# EAGLE design IOTKit_V1 (EAGLE 6.4)

## Sheet 1 of 2
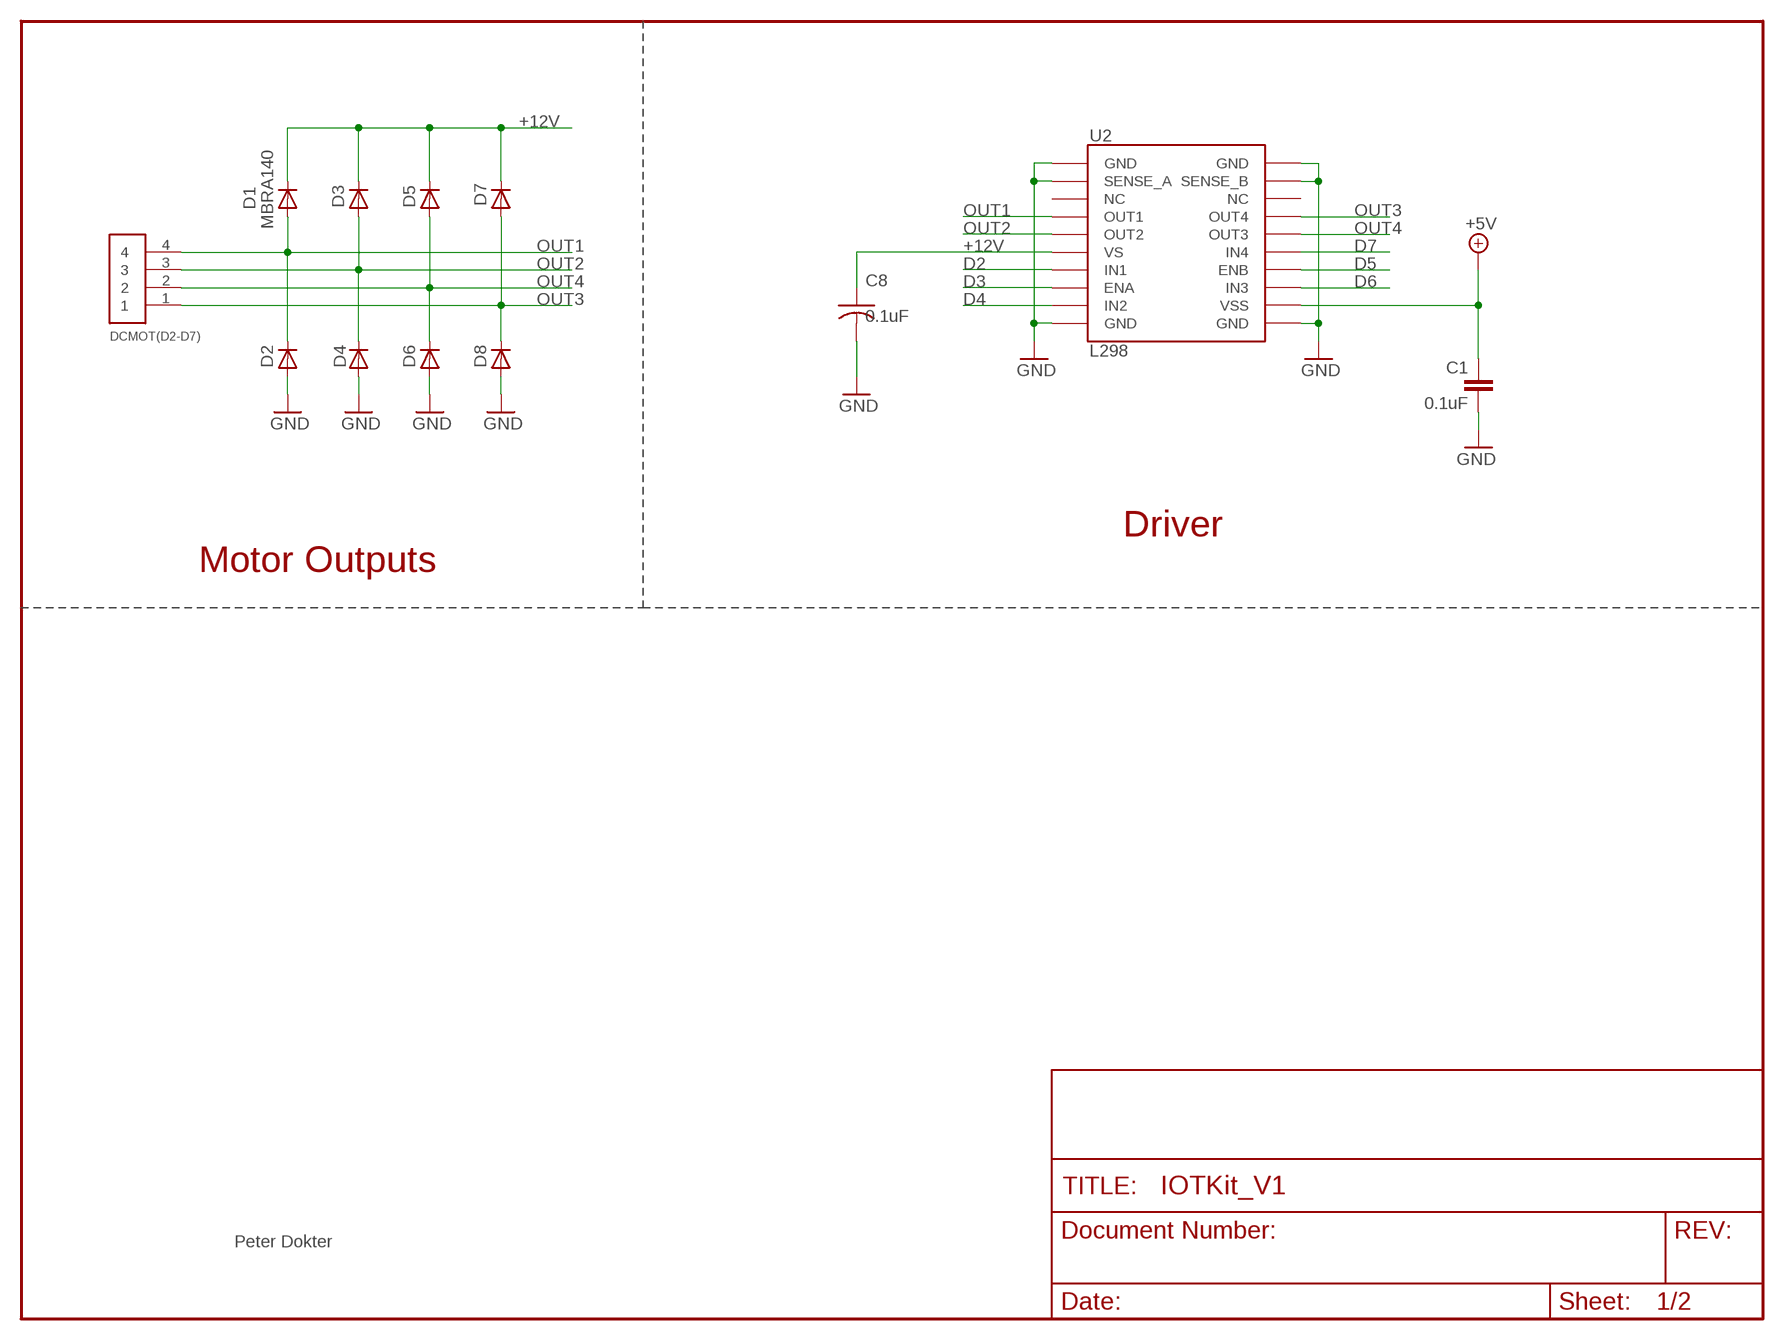
[diagram p0: schematic, sheet 1]

### Parts
C1  0.1uF  CAP0402-CAP  [0402-CAP]
C8  0.1uF  C-USC0603K  [C0603K]
D1  MBRA140  DIODESMA  [SMA-DIODE]
D2  MBRA140  DIODESMA  [SMA-DIODE]
D3  MBRA140  DIODESMA  [SMA-DIODE]
D4  MBRA140  DIODESMA  [SMA-DIODE]
D5  MBRA140  DIODESMA  [SMA-DIODE]
D6  MBRA140  DIODESMA  [SMA-DIODE]
D7  MBRA140  DIODESMA  [SMA-DIODE]
D8  MBRA140  DIODESMA  [SMA-DIODE]
DCMOT(D2-D7)  1X4  [1X04_LINE]
U2  L298  L298_BRIDGE_DRIVER  [POWERSO20]

### Nets
+5V: C1.1 U2.P$12(VSS) ; also sheet 2
+12V: C8.1 D1.C D3.C D5.C D7.C U2.P$6(VS) ; also sheet 2
D2: U2.P$7(IN1) ; also sheet 2
D3: U2.P$8(ENA) ; also sheet 2
D4: U2.P$9(IN2) ; also sheet 2
D5: U2.P$14(ENB) ; also sheet 2
D6: U2.P$13(IN3) ; also sheet 2
D7: U2.P$15(IN4) ; also sheet 2
GND: C1.2 C8.2 D2.A D4.A D6.A D8.A U2.P$1(GND) U2.P$2(SENSE_A) U2.P$10(GND) U2.P$11(GND) U2.P$19(SENSE_B) U2.P$20(GND) ; also sheet 2
OUT1: D1.A D2.C DCMOT(D2-D7).4 U2.P$4(OUT1)
OUT2: D3.A D4.C DCMOT(D2-D7).3 U2.P$5(OUT2)
OUT3: D7.A D8.C DCMOT(D2-D7).1 U2.P$17(OUT4)
OUT4: D5.A D6.C DCMOT(D2-D7).2 U2.P$16(OUT3)
Unconnected: U2.P$3(NC) U2.P$18(NC)

### Notes on the sheet
- Driver
- Motor Outputs
- Peter Dokter

## Sheet 2 of 2
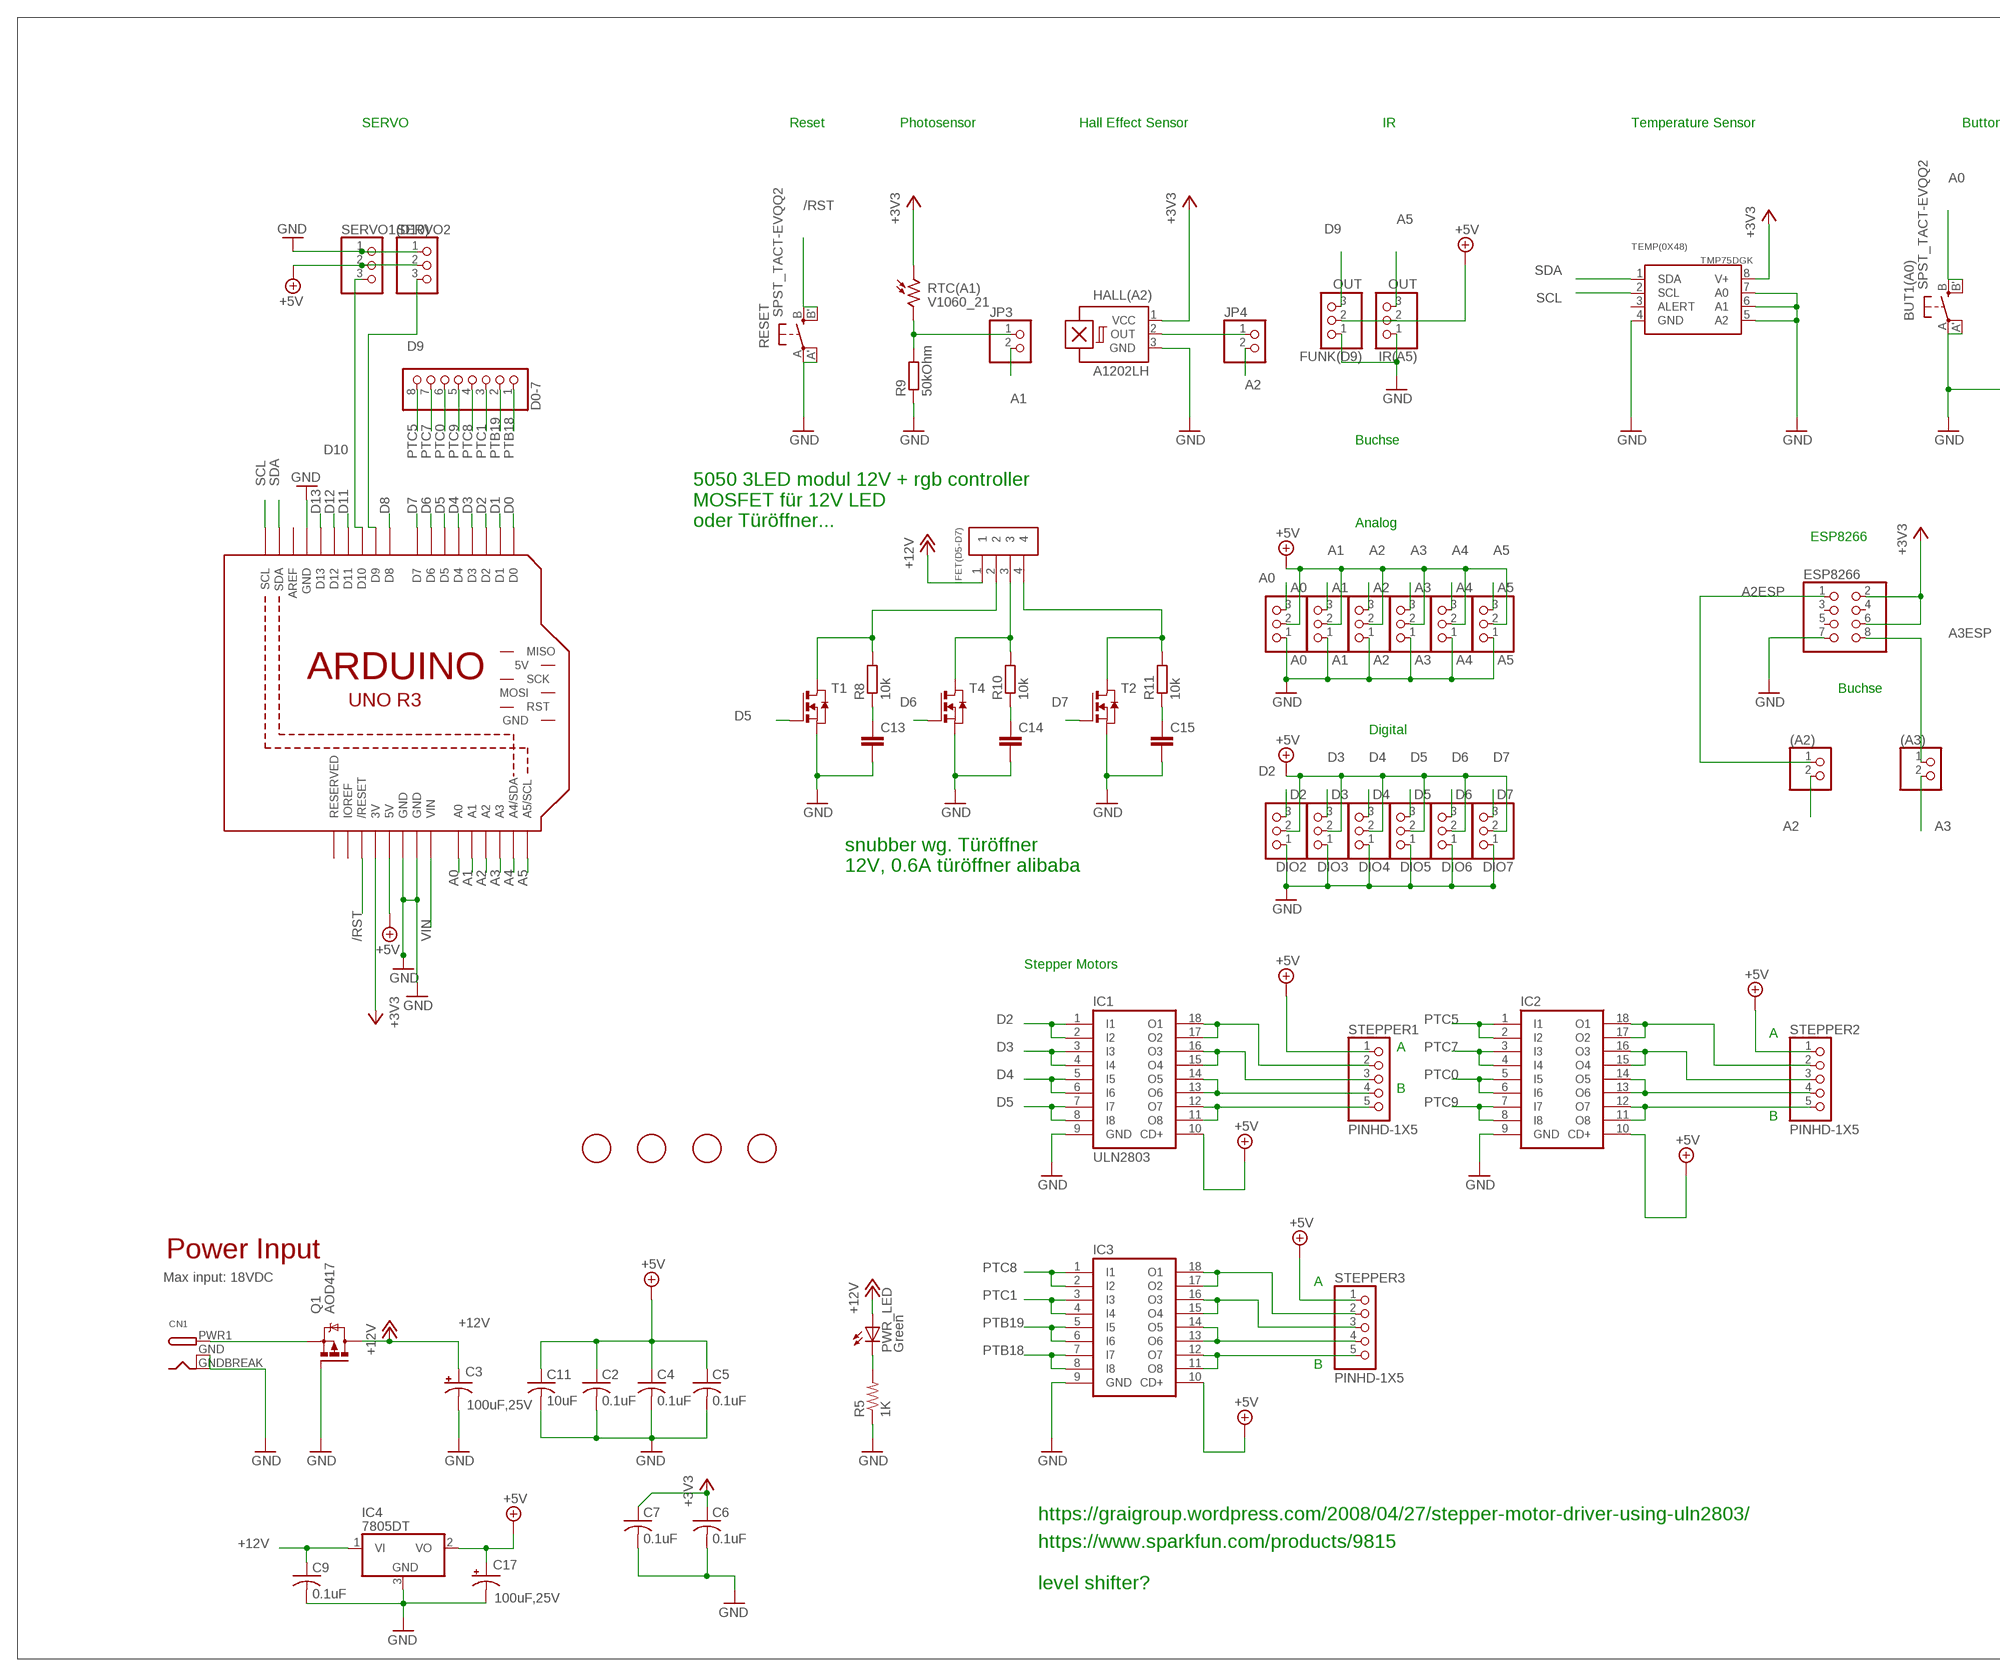
[diagram p1: schematic, sheet 2, part 1 of 2]
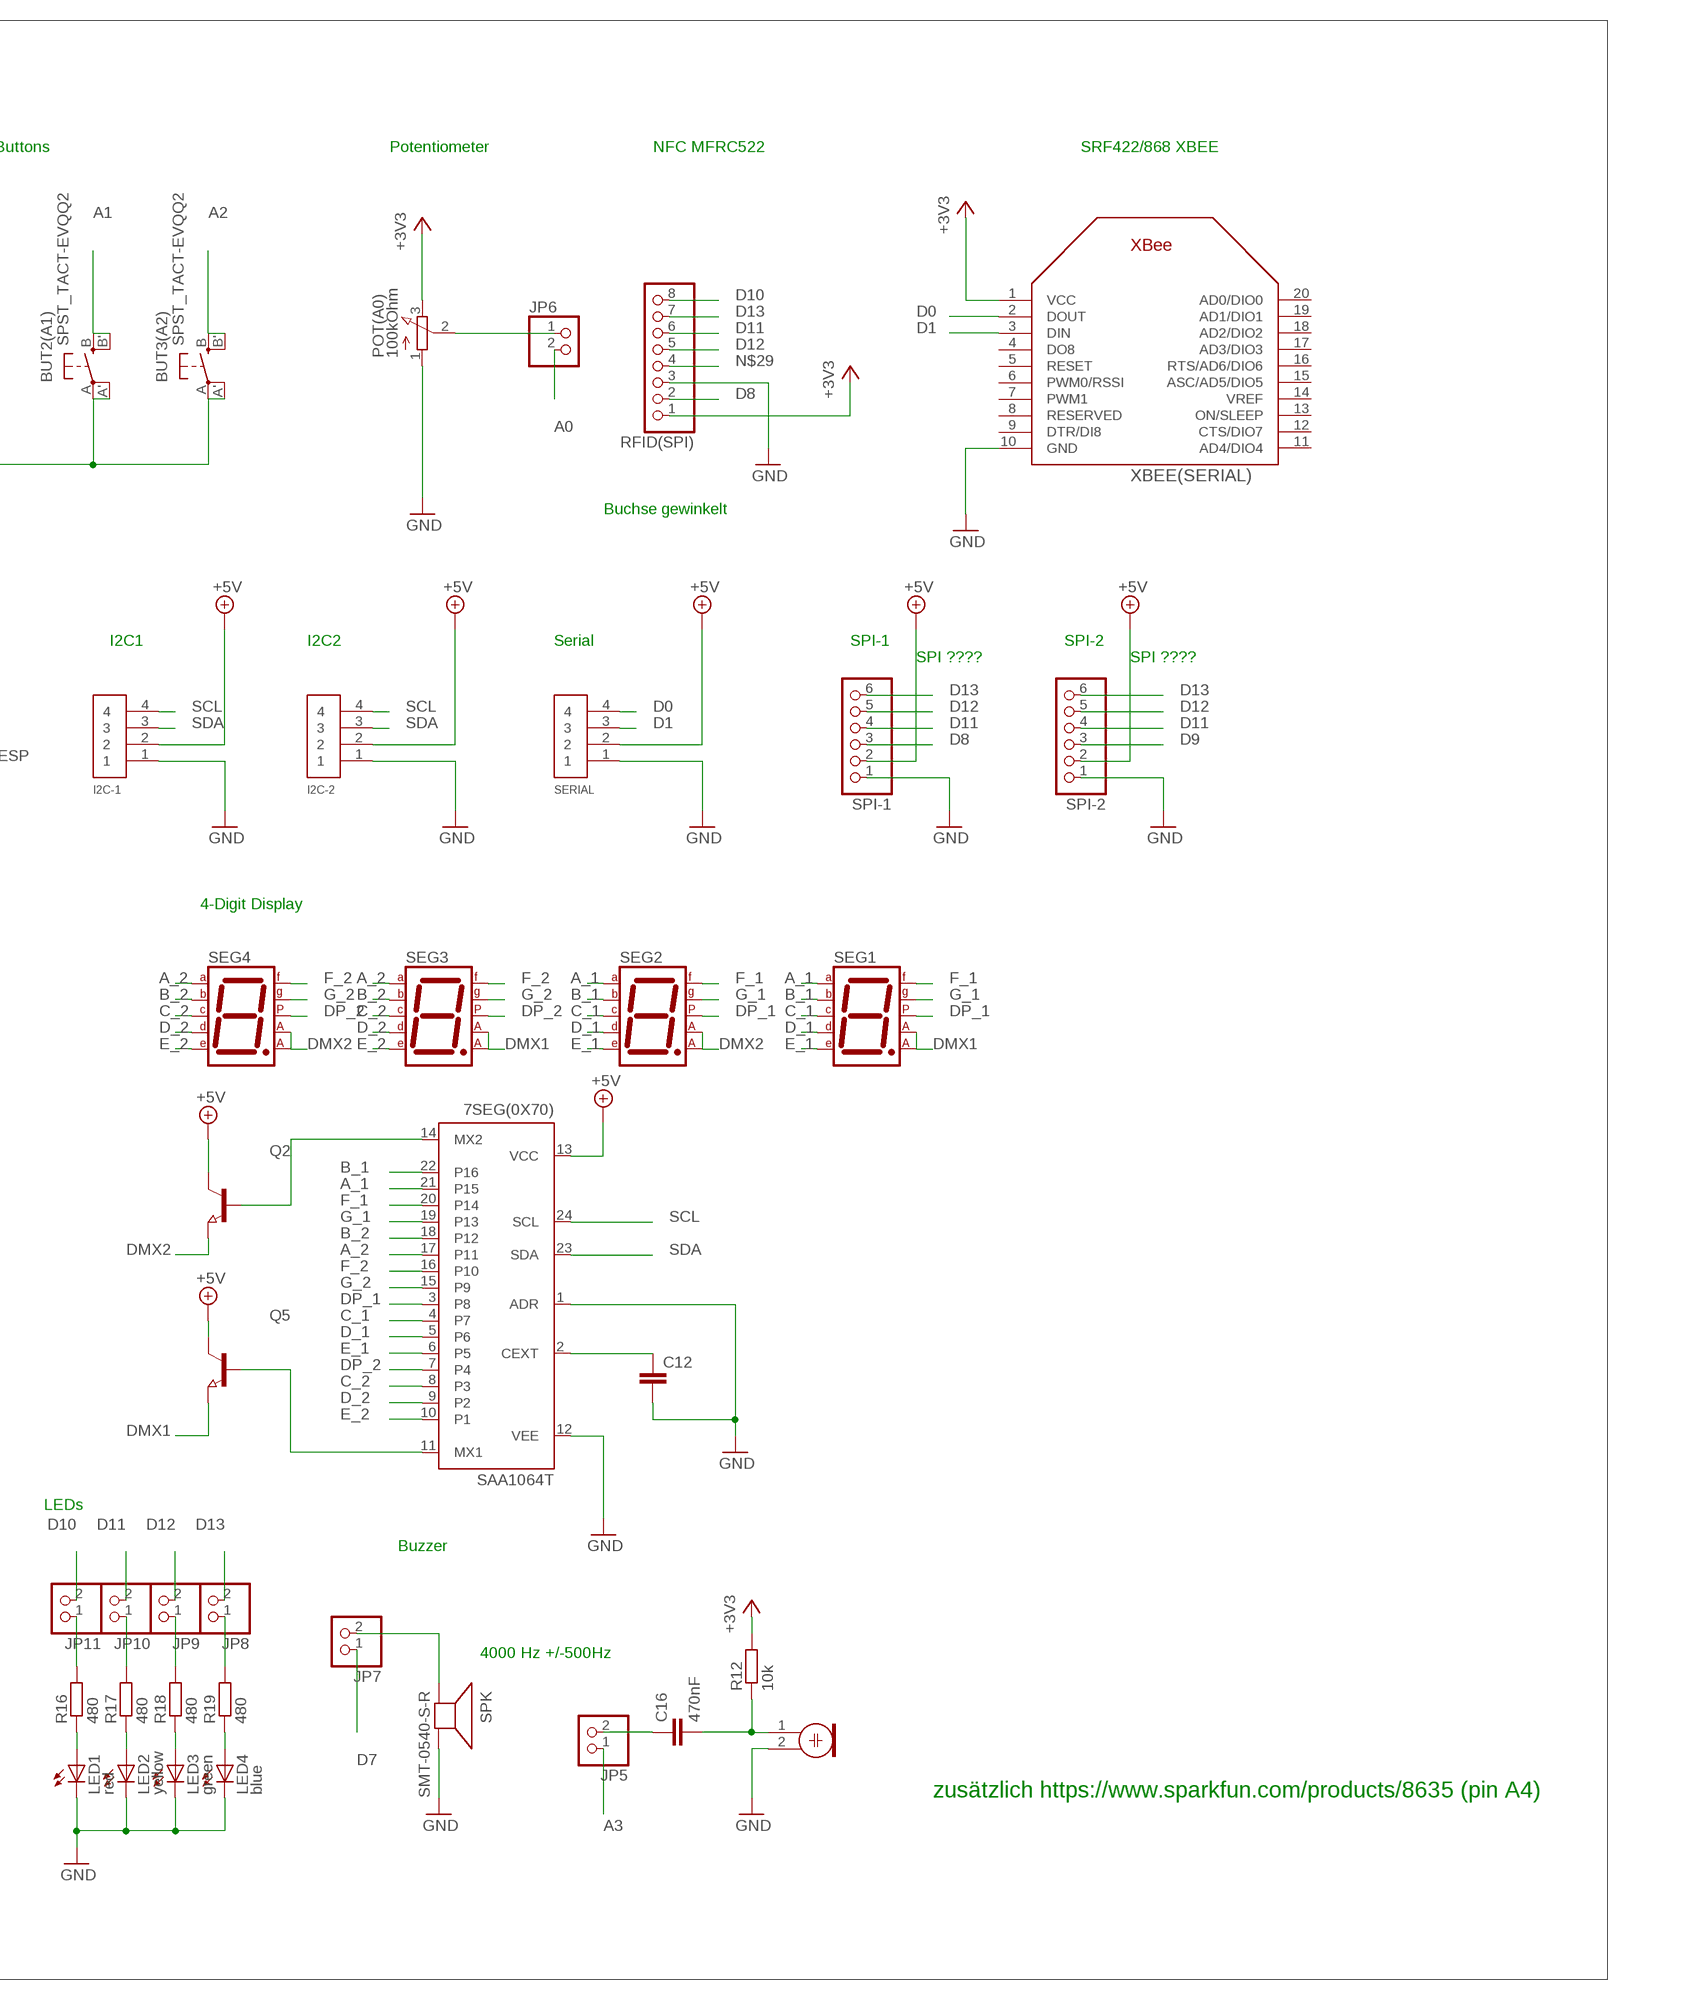
[diagram p2: schematic, sheet 2, part 2 of 2]

### Parts
7SEG(0X70)  SAA1064T  [SO24]
(A2)  PINHD-1X2  [1X02_LINE]
(A3)  PINHD-1X2  [1X02_LINE]
A0  A0  PINHD-1X3  [1X03_LINE]
A1  A1  PINHD-1X3  [1X03_LINE]
A2  A2  PINHD-1X3  [1X03_LINE]
A3  A3  PINHD-1X3  [1X03_LINE]
A4  A4  PINHD-1X3  [1X03_LINE]
A5  A5  PINHD-1X3  [1X03_LINE]
BUT1(A0)  SPST_TACT-EVQQ2  [EVQ-Q2]
BUT2(A1)  SPST_TACT-EVQQ2  [EVQ-Q2]
BUT3(A2)  SPST_TACT-EVQQ2  [EVQ-Q2]
C2  0.1uF  C-USC0603K  [C0603K]
C3  100uF,25V  CAP_POLF80  [NIPPON_F80]
C4  0.1uF  C-USC0603K  [C0603K]
C5  0.1uF  C-USC0603K  [C0603K]
C6  0.1uF  C-USC0603K  [C0603K]
C7  0.1uF  C-USC0603K  [C0603K]
C9  0.1uF  C-USC0805K  [C0805K]
C11  10uF  C-USC0805K  [C0805K]
C12  C-EUC0603  [C0603]
C13  C-EUC0603  [C0603]
C14  C-EUC0603  [C0603]
C15  C-EUC0603  [C0603]
C16  470nF  C-EUC0603  [C0603]
C17  100uF,25V  CAP_POLF80  [NIPPON_F80]
CN1  DCBARRELSMT  [DCJACK_2MM_SMT]
D0-7  PINHD-1X8CLEANBIG  [1X08-CLEANBIG]
DIO2  D2  PINHD-1X3  [1X03_LINE]
DIO3  D3  PINHD-1X3  [1X03_LINE]
DIO4  D4  PINHD-1X3  [1X03_LINE]
DIO5  D5  PINHD-1X3  [1X03_LINE]
DIO6  D6  PINHD-1X3  [1X03_LINE]
DIO7  D7  PINHD-1X3  [1X03_LINE]
ESP8266  PINHD-2X4  [2X04]
FET(D5-D7)  1X4  [1X04_LINE]
FUNK(D9)  OUT  PINHD-1X3  [1X03_LINE]
HALL(A2)  A1202LH  [SOT23-W]
I2C-1  1X4  [1X04_LINE]
I2C-2  1X4  [1X04_LINE]
IC1  ULN2803  ULN2803ASO18W  [SO18W]
IC2  ULN2803ASO18W  [SO18W]
IC3  ULN2803ASO18W  [SO18W]
IC4  7805DT  [TO252]
IR(A5)  OUT  PINHD-1X3  [1X03_LINE]
JP3  PINHD-1X2  [1X02_LINE]
JP4  PINHD-1X2  [1X02_LINE]
JP5  PINHD-1X2  [1X02_LINE]
JP6  PINHD-1X2  [1X02_LINE]
JP7  PINHD-1X2  [1X02_LINE]
JP8  PINHD-1X2  [1X02_LINE]
JP9  PINHD-1X2  [1X02_LINE]
JP10  PINHD-1X2  [1X02_LINE]
JP11  PINHD-1X2  [1X02_LINE]
LED1  red  LEDCHIP-LED0603  [CHIP-LED0603]
LED2  yellow  LEDCHIP-LED0603  [CHIP-LED0603]
LED3  green  LEDCHIP-LED0603  [CHIP-LED0603]
LED4  blue  LEDCHIP-LED0603  [CHIP-LED0603]
MIC(A3)  ELECTRET_MICROPHON-WM-62PC/62PK  [WM-62PC/62PK]
POT(A0)  100kOhm  EVUF3A  [EVUF]
PWR_LED  Green  LEDCHIP-LED0805  [CHIP-LED0805]
Q1  AOD417  IRFR5305  [D-PAK_TO252AA]
Q2  NPN-TRANSISTOR_SOT23  [SOT23]
Q5  NPN-TRANSISTOR_SOT23  [SOT23]
R5  1K  R-US_R0805  [R0805]
R8  10k  R-EU_R0805  [R0805]
R9  50kOhm  R-EU_R0603  [R0603]
R10  10k  R-EU_R0805  [R0805]
R11  10k  R-EU_R0805  [R0805]
R12  10k  R-EU_R0603  [R0603]
R16  480  R-EU_R0603  [R0603]
R17  480  R-EU_R0603  [R0603]
R18  480  R-EU_R0603  [R0603]
R19  480  R-EU_R0603  [R0603]
RESET  SPST_TACT-EVQQ2  [EVQ-Q2]
RFID(SPI)  PINHD-1X8BIG  [1X08-BIG]
RTC(A1)  V1060_21  [TO-5_V10]
SEG1  7SEG-MCK  [7SEG-7]
SEG2  7SEG-MCK  [7SEG-7]
SEG3  7SEG-MCK  [7SEG-7]
SEG4  7SEG-MCK  [7SEG-7]
SERIAL  1X4  [1X04_LINE]
SERVO1(D10)  PINHD-1X3  [1X03]
SERVO2  PINHD-1X3  [1X03]
SPI-1  PINHD-1X6B  [1X06-BIG]
SPI-2  PINHD-1X6B  [1X06-BIG]
SPK  SMT-0540-S-R  [SMT-0540-S-R]
STEPPER1  PINHD-1X5  [1X05]
STEPPER2  PINHD-1X5  [1X05]
STEPPER3  PINHD-1X5  [1X05]
T1  NMOSSOT223  [SOT223]
T2  NMOSSOT223  [SOT223]
T4  NMOSSOT223  [SOT223]
TEMP(0X48)  TMP75DGK  [MSOP8]
U$1  FIDUCIAL  [FIDUCIAL_1MM]
U$2  FIDUCIAL  [FIDUCIAL_1MM]
U$3  FIDUCIAL  [FIDUCIAL_1MM]
U$5  ARDUINO_R3_ICSP_NODIM  [ARDUINOR3_ICSP_NODIM]
U$6  FIDUCIAL  [FIDUCIAL_1MM]
XBEE(SERIAL)  XBEE  [XBEE]

### Nets
+3V3: C6.1 C7.1 ESP8266.2 ESP8266.6 HALL(A2).1(VCC) POT(A0).3(E) R12.2 RFID(SPI).1 RTC(A1).1 TEMP(0X48).8(V+) U$5.3V XBEE(SERIAL).1(VCC)
+5V: 7SEG(0X70).13(VCC) A0.2 A1.2 A2.2 A3.2 A4.2 A5.2 C2.1 C4.1 C5.1 C11.1 C17.+ DIO2.2 DIO3.2 DIO4.2 DIO5.2 DIO6.2 DIO7.2 FUNK(D9).2 I2C-1.2 I2C-2.2 IC1.10(CD+) IC2.10(CD+) IC3.10(CD+) IC4.2(VO) IR(A5).2 Q2.3(C) Q5.3(C) SERIAL.2 SERVO1(D10).2 SERVO2.2 SPI-1.2 SPI-2.2 STEPPER1.1 STEPPER2.1 STEPPER3.1 U$5.5V ; also sheet 1
+12V: C3.+ C9.1 FET(D5-D7).1 IC4.1(VI) PWR_LED.A Q1.4(D) ; also sheet 1
/RST: RESET.B'(S1) RESET.B(S) U$5.RESET(/RESET)
A0: A0.3 BUT1(A0).B'(S1) BUT1(A0).B(S) JP6.2 U$5.A0
A1: A1.3 BUT2(A1).B'(S1) BUT2(A1).B(S) JP3.2 U$5.A1
A2: (A2).2 A2.3 BUT3(A2).B'(S1) BUT3(A2).B(S) JP4.2 U$5.A2
A2ESP: (A2).1 ESP8266.1
A3: (A3).2 A3.3 JP5.1 U$5.A3
A3ESP: (A3).1 ESP8266.8
A4: A4.3 U$5.A4(A4/SDA)
A5: A5.3 IR(A5).3 U$5.A5(A5/SCL)
A_1: 7SEG(0X70).21(P15) SEG1.7(A) SEG2.7(A)
A_2: 7SEG(0X70).17(P11) SEG3.7(A) SEG4.7(A)
B_1: 7SEG(0X70).22(P16) SEG1.6(B) SEG2.6(B)
B_2: 7SEG(0X70).18(P12) SEG3.6(B) SEG4.6(B)
C_1: 7SEG(0X70).4(P7) SEG1.4(C) SEG2.4(C)
C_2: 7SEG(0X70).8(P3) SEG3.4(C) SEG4.4(C)
D0: SERIAL.4 U$5.D0 XBEE(SERIAL).2(DOUT)
D1: SERIAL.3 U$5.D1 XBEE(SERIAL).3(DIN)
D2: DIO2.3 IC1.1(I1) IC1.2(I2) U$5.D2 ; also sheet 1
D3: DIO3.3 IC1.3(I3) IC1.4(I4) U$5.D3 ; also sheet 1
D4: DIO4.3 IC1.5(I5) IC1.6(I6) U$5.D4 ; also sheet 1
D5: DIO5.3 IC1.7(I7) IC1.8(I8) T1.1(G) U$5.D5 ; also sheet 1
D6: DIO6.3 T4.1(G) U$5.D6 ; also sheet 1
D7: DIO7.3 JP7.1 T2.1(G) U$5.D7 ; also sheet 1
D8: RFID(SPI).2 SPI-1.3 U$5.D8
D9: FUNK(D9).3 SERVO2.3 SPI-2.3 U$5.D9
D10: JP11.2 RFID(SPI).8 SERVO1(D10).3 U$5.D10
D11: JP10.2 RFID(SPI).6 SPI-1.4 SPI-2.4 U$5.D11
D12: JP9.2 RFID(SPI).5 SPI-1.5 SPI-2.5 U$5.D12
D13: JP8.2 RFID(SPI).7 SPI-1.6 SPI-2.6 U$5.D13
D_1: 7SEG(0X70).5(P6) SEG1.2(D) SEG2.2(D)
D_2: 7SEG(0X70).9(P2) SEG3.2(D) SEG4.2(D)
DMX1: Q5.2(E) SEG1.3(CA1) SEG1.8(CA2) SEG3.3(CA1) SEG3.8(CA2)
DMX2: Q2.2(E) SEG2.3(CA1) SEG2.8(CA2) SEG4.3(CA1) SEG4.8(CA2)
DP_1: 7SEG(0X70).3(P8) SEG1.5(DP) SEG2.5(DP)
DP_2: 7SEG(0X70).7(P4) SEG3.5(DP) SEG4.5(DP)
E_1: 7SEG(0X70).6(P5) SEG1.1(E) SEG2.1(E)
E_2: 7SEG(0X70).10(P1) SEG3.1(E) SEG4.1(E)
F_1: 7SEG(0X70).20(P14) SEG1.9(F) SEG2.9(F)
F_2: 7SEG(0X70).16(P10) SEG3.9(F) SEG4.9(F)
G_1: 7SEG(0X70).19(P13) SEG1.10(G) SEG2.10(G)
G_2: 7SEG(0X70).15(P9) SEG3.10(G) SEG4.10(G)
GND: 7SEG(0X70).1(ADR) 7SEG(0X70).12(VEE) A0.1 A1.1 A2.1 A3.1 A4.1 A5.1 BUT1(A0).A'(P1) BUT1(A0).A(P) BUT2(A1).A'(P1) BUT2(A1).A(P) BUT3(A2).A'(P1) BUT3(A2).A(P) C2.2 C3.- C4.2 C5.2 C6.2 C7.2 C9.2 C11.2 C12.2 C13.2 C14.2 C15.2 C17.- CN1.GND(GNDBREAK) CN1.GNDBREAK(GND) DIO2.1 DIO3.1 DIO4.1 DIO5.1 DIO6.1 DIO7.1 ESP8266.7 FUNK(D9).1 HALL(A2).3(GND) I2C-1.1 I2C-2.1 IC1.9(GND) IC2.9(GND) IC3.9(GND) IC4.3(GND) IR(A5).1 LED1.C LED2.C LED3.C LED4.C MIC(A3).2 POT(A0).1(A) Q1.1(G) R5.1 R9.1 RESET.A'(P1) RESET.A(P) RFID(SPI).3 SERIAL.1 SERVO1(D10).1 SERVO2.1 SPI-1.1 SPI-2.1 SPK.+(-) T1.3(S) T2.3(S) T4.3(S) TEMP(0X48).4(GND) TEMP(0X48).5(A2) TEMP(0X48).6(A1) TEMP(0X48).7(A0) U$5.GND U$5.GND@1(GND) U$5.GND@3(GND) XBEE(SERIAL).10(GND) ; also sheet 1
N$2: CN1.PWR1(PWR) Q1.3(S)
N$3: JP3.1 R9.2 RTC(A1).2
N$4: HALL(A2).2(OUT) JP4.1
N$5: C16.1 JP5.2
N$7: JP6.1 POT(A0).2(S)
N$8: JP7.2 SPK.-(+)
N$9: JP11.1 R16.2
N$10: JP10.1 R17.2
N$11: JP9.1 R18.2
N$12: JP8.1 R19.2
N$20: LED1.A R16.1
N$21: LED2.A R17.1
N$22: LED3.A R18.1
N$23: LED4.A R19.1
N$24: IC2.11(O8) IC2.12(O7) STEPPER2.5
N$25: IC2.13(O6) IC2.14(O5) STEPPER2.4
N$26: IC2.15(O4) IC2.16(O3) STEPPER2.3
N$27: IC2.17(O2) IC2.18(O1) STEPPER2.2
N$28: 7SEG(0X70).14(MX2) Q2.1(B)
N$29: RFID(SPI).4
N$30: 7SEG(0X70).11(MX1) Q5.1(B)
N$33: 7SEG(0X70).2(CEXT) C12.1
N$34: C13.1 R8.1
N$35: FET(D5-D7).2 R8.2 T1.2(D) T1.4(D)
N$36: C14.1 R10.1
N$37: FET(D5-D7).3 R10.2 T4.2(D) T4.4(D)
N$38: C15.1 R11.1
N$39: FET(D5-D7).4 R11.2 T2.2(D) T2.4(D)
N$40: C16.2 MIC(A3).1 R12.1
N$41: IC1.11(O8) IC1.12(O7) STEPPER1.5
N$42: IC1.13(O6) IC1.14(O5) STEPPER1.4
N$43: IC1.15(O4) IC1.16(O3) STEPPER1.3
N$44: IC1.17(O2) IC1.18(O1) STEPPER1.2
N$45: IC3.11(O8) IC3.12(O7) STEPPER3.5
N$46: IC3.13(O6) IC3.14(O5) STEPPER3.4
N$47: IC3.15(O4) IC3.16(O3) STEPPER3.3
N$48: IC3.17(O2) IC3.18(O1) STEPPER3.2
PTB18: D0-7.1 IC3.7(I7) IC3.8(I8)
PTB19: D0-7.2 IC3.5(I5) IC3.6(I6)
PTC0: D0-7.6 IC2.5(I5) IC2.6(I6)
PTC1: D0-7.3 IC3.3(I3) IC3.4(I4)
PTC5: D0-7.8 IC2.1(I1) IC2.2(I2)
PTC7: D0-7.7 IC2.3(I3) IC2.4(I4)
PTC8: D0-7.4 IC3.1(I1) IC3.2(I2)
PTC9: D0-7.5 IC2.7(I7) IC2.8(I8)
PWR_LED: PWR_LED.C R5.2
SCL: 7SEG(0X70).24(SCL) I2C-1.4 I2C-2.4 TEMP(0X48).2(SCL) U$5.SCL
SDA: 7SEG(0X70).23(SDA) I2C-1.3 I2C-2.3 TEMP(0X48).1(SDA) U$5.SDA
VIN: U$5.VIN
Unconnected: ESP8266.3 ESP8266.4 ESP8266.5 TEMP(0X48).3(ALERT) U$5.5V_ICSP(5V) U$5.AREF U$5.GND@2(GND) U$5.IOREF U$5.MISO U$5.MOSI U$5.RESERVED U$5.RESET_ICSP(RST) U$5.SCK XBEE(SERIAL).4(DO8) XBEE(SERIAL).5(RESET) XBEE(SERIAL).6(PWM0/RSSI) XBEE(SERIAL).7(PWM1) XBEE(SERIAL).8(RESERVED) XBEE(SERIAL).9(DTR/DI8) XBEE(SERIAL).11(AD4/DIO4) XBEE(SERIAL).12(CTS/DIO7) XBEE(SERIAL).13(ON/SLEEP) XBEE(SERIAL).14(VREF) XBEE(SERIAL).15(ASC/AD5/DIO5) XBEE(SERIAL).16(RTS/AD6/DIO6) XBEE(SERIAL).17(AD3/DIO3) XBEE(SERIAL).18(AD2/DIO2) XBEE(SERIAL).19(AD1/DIO1) XBEE(SERIAL).20(AD0/DIO0)

### Notes on the sheet
- SERVO | Reset | Photosensor | Hall Effect Sensor | IR | Temperature Sensor | Buttons | Potentiometer | NFC MFRC522 | SRF422/868 XBEE
- Buchse gewinkelt
- Buchse
- 5050 3LED modul 12V + rgb controller
- MOSFET für 12V LED
  oder Türöffner...
- Analog
- ESP8266 | I2C1 | I2C2 | Serial | SPI-1 | SPI-2
- SPI ???? | SPI ????
- Buchse
- Digital
- 4-Digit Display
- snubber wg. Türöffner
  12V, 0.6A türöffner alibaba
- Stepper Motors
- A
- A
- B
- B
- Power Input
- LEDs
- Max input: 18VDC
- A
- Buzzer
- B
- 4000 Hz +/-500Hz
- zusätzlich https://www.sparkfun.com/products/8635 (pin A4)
- https://graigroup.wordpress.com/2008/04/27/stepper-motor-driver-using-uln2803/
- https://www.sparkfun.com/products/9815
- level shifter?

## Library data of the parts
7SEG(0X70) = micro-philips:SAA1064: I2C-Bus 4-digit LED-DRIVER; MPN: SAA1064T/N2,118; OC_FARNELL: unknown; OC_NEWARK: 70R8648
(A2) (A3) JP3-JP11 = Gaudi:PINHD-1X2: PIN HEADER
A0 A1-A5 DIO2-DIO7 FUNK(D9) IR(A5) = Gaudi:PINHD-1X3: PIN HEADER
BUT1(A0) BUT2(A1) BUT3(A2) RESET = adafruit:SPST_TACT: SMT 6mm switch, EVQQ2 series http://www.ladyada.net/library/eagle
C1 = SparkFun:CAP: Capacitor Standard 0603 ceramic capacitor, and 0.1" leaded capacitor.
C2 C4-C9 C11 = adafruit:C-US: CAPACITOR, American symbol
C3 C17 = SparkFun:CAP_POL: Capacitor Polarized These are standard SMD and PTH capacitors. Normally 10uF, 47uF, and 100uF in electrolytic and tantalum varieties. Always verify the external diameter of the through hole cap, it varies with capacity, voltage, and manufacturer. The EIA devices should be standard.
C12-C16 = resistor:C-EU: CAPACITOR, European symbol
CN1 = adafruit:DCBARREL: 2.0mm DC Barrel Jack DCJACK_2MM_PTH - Through Hole Jack (4UConnector: 05537)
D0-7 RFID(SPI) = adafruit:PINHD-1X8: PIN HEADER
D1-D8 = SparkFun:DIODE: Diode These are standard reverse protection diodes and small signal diodes. SMA package can handle up to about 1A. SOD-323 can handle about 200mA. What the SOD-323 package when ordering, there are some mfgs out there that are 5-pin packages.
DCMOT(D2-D7) FET(D5-D7) I2C-1 I2C-2 SERIAL = Gaudi:1X4: 4-pin connector
ESP8266 = adafruit:PINHD-2X4: PIN HEADER
HALL(A2) = allegro:A12*?: Hall-effect bipolar switch Source: http://www.allegromicro.com/en/Products/Part_Numbers/1202/1202.pdf; OC_FARNELL: unknown; OC_NEWARK: unknown
IC1-IC3 = IOTKit:ULN2803A: DRIVER ARRAY
IC4 = adafruit:78*: Positive VOLTAGE REGULATOR Added bigger pads to the TO-92 package
LED1-LED4 PWR_LED = adafruit:LED: LED OSRAM: - CHIPLED LG R971, LG N971, LY N971, LG Q971, LY Q971, LO R971, LY R971 LH N974, LH R974 LS Q976, LO Q976, LY Q976 LO Q996 - Hyper CHIPLED LW Q18S LB Q993, LB Q99A, LB R99A - SideLED LS A670, LO A670, LY A670, LG A670, LP A670 LB A673, LV A673, LT A673, LW A673 LH A674 LY A675 LS A676, LA A676, LO A676, LY A676, LW A676 LS A679, LY A679, LG A679 - Hyper Micro SIDELED® LS Y876, LA Y876, LO Y876, LY Y876 LT Y87S - SmartLED LW L88C, LW L88S LB L89C, LB L89S, LG L890 LS L89K, LO L89K, LY L89K LS L896, LA L896, LO L896, LY L896 - TOPLED LS T670, LO T670, LY T670, LG T670, LP T670 LSG T670, LSP T670, LSY T670, LOP T670, LYG T670 LG T671, LOG T671, LSG T671 LB T673, LV T673, LT T673, LW T673 LH T674 LS T676, LA T676, LO T676, LY T676, LB T676, LH T676, LSB T676, LW T676 LB T67C, LV T67C, LT T67C, LS T67K, LO T67K, LY T67K, LW E67C LS E67B, LA E67B, LO E67B, LY E67B, LB E67C, LV E67C, LT E67C LW T67C LS T679, LY T679, LG T679 LS T770, LO T770, LY T770, LG T770, LP T770 LB T773, LV T773, LT T773, LW T773 LH T774 LS E675, LA E675, LY E675, LS T675 LS T776, LA T776, LO T776, LY T776, LB T776 LHGB T686 LT T68C, LB T68C - Hyper Mini TOPLED® LB M676 - Mini TOPLED Santana® LG M470 LS M47K, LO M47K, LY M47K Source: http://www.osram.convergy.de/
MIC(A3) = microphon:ELECTRET_MICROPHON-: Electret Condenser Microphone
POT(A0) = Gaudi:EVU: 9 mm Square Rotary Potentiometers Source: Panasonic
Q1 = transistor-power:IRF?5305: HEXFET Power MOSFET Source: http://www.irf.com/product-info/datasheets/data/irfr5305pbf.pdf
Q2 Q5 = semicon-smd-ipc:NPN-TRANSISTOR_: NPN TRANSISTOR
R5 = adafruit:R-US_: RESISTOR, American symbol
R8-R12 R16-R19 = rcl:R-EU_: RESISTOR, European symbol
RTC(A1) = photo-elements:?1060*: Sensor Street Light control Source: http://optoelectronics.perkinelmer.com/content/Datasheets/DTS_PhotocellsB1060.pdf
SEG1-SEG4 = Gaudi:7SEG-MCK: 7-segment DISPLAY single cathode, 13 mm
SERVO1(D10) SERVO2 = adafruit:PINHD-1X3: PIN HEADER
SPI-1 SPI-2 = adafruit:PINHD-1X6: PIN HEADER
SPK = adafruit:SMT-0540-S-R: SMT-0549-S-R Small surface-mount magnetic buzzer
STEPPER1-STEPPER3 = Gaudi:PINHD-1X5
T1 T2 T4 = zetex:NMOSSOT223: MOS FET; OC_FARNELL: unknown; OC_NEWARK: unknown
TEMP(0X48) = ti_tmp:TMP75
U2 = SparkFun:L298_BRIDGE_DRIVER
U$1-U$3 U$6 = adafruit:FIDUCIAL: For use by pick and place machines to calibrate the vision/machine, 1mm By microbuilder.eu
U$5 = adafruit:ARDUINO_R3_ICSP
XBEE(SERIAL) = adafruit:XBEE

## Net classes
1 power: width 0.61 mm

## Board
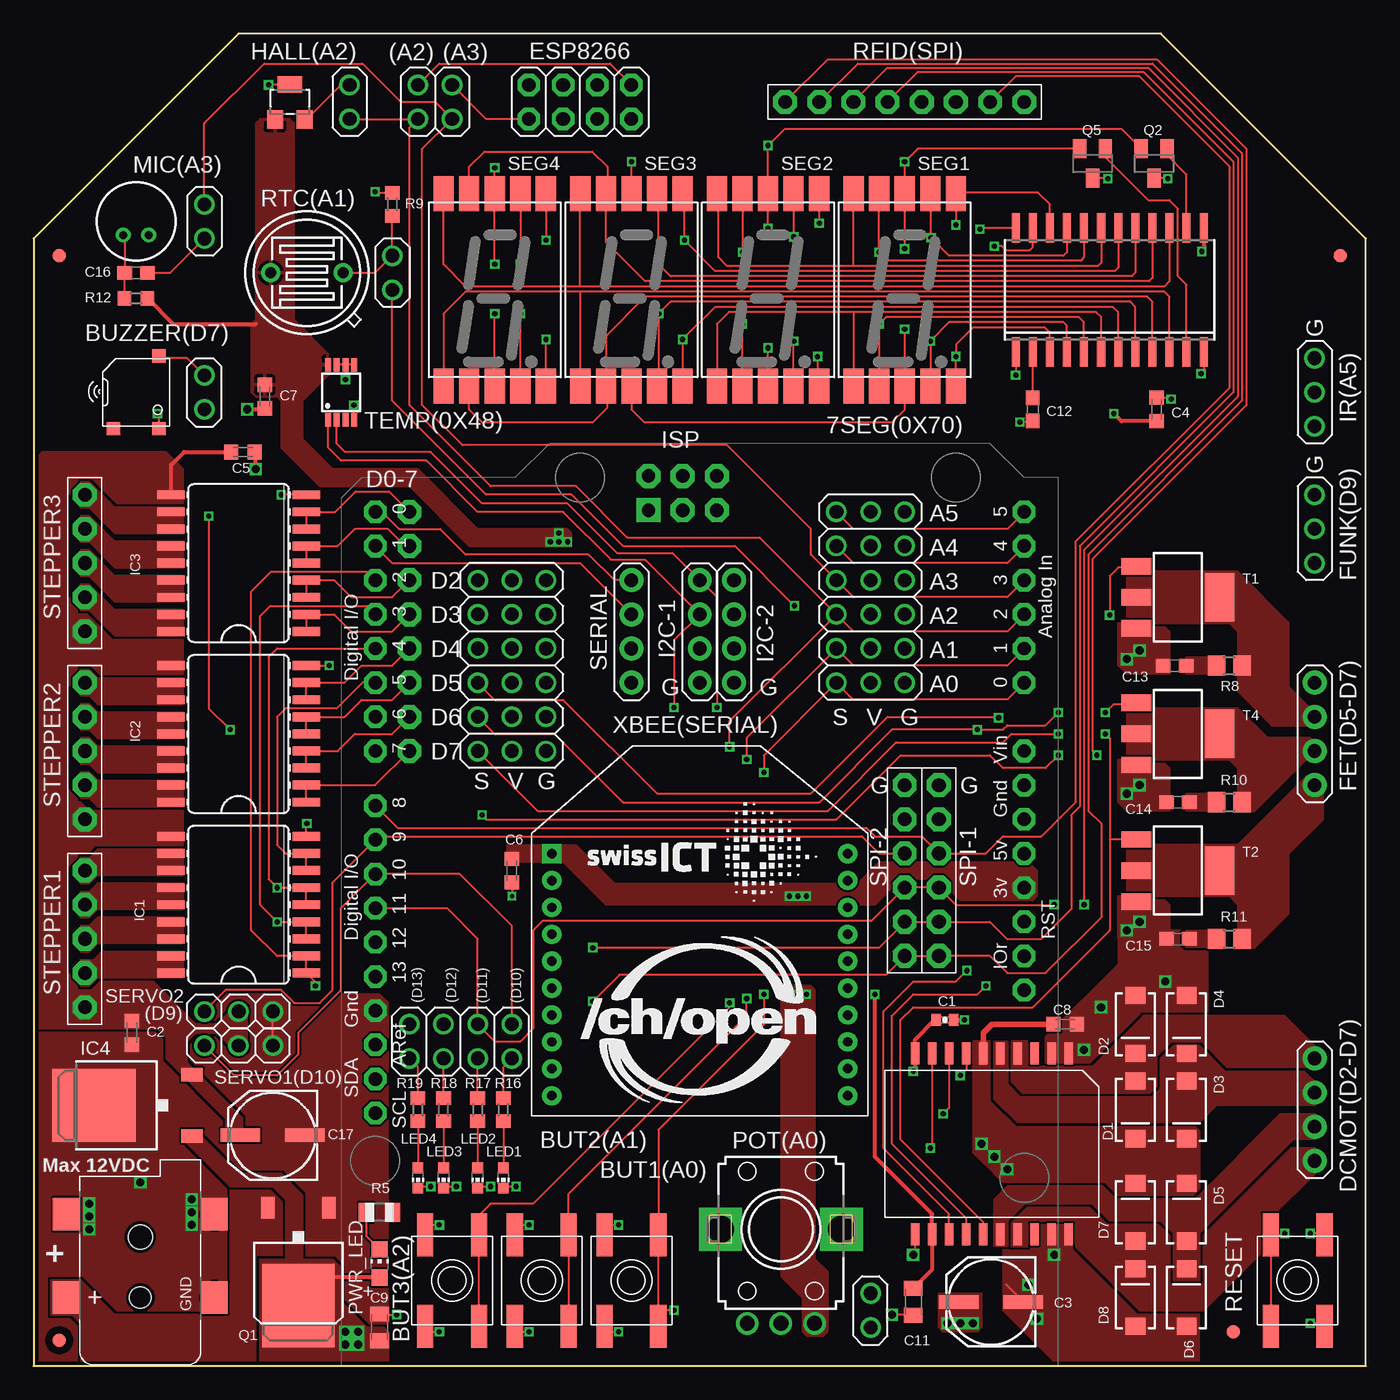
[diagram p3: board, top side]
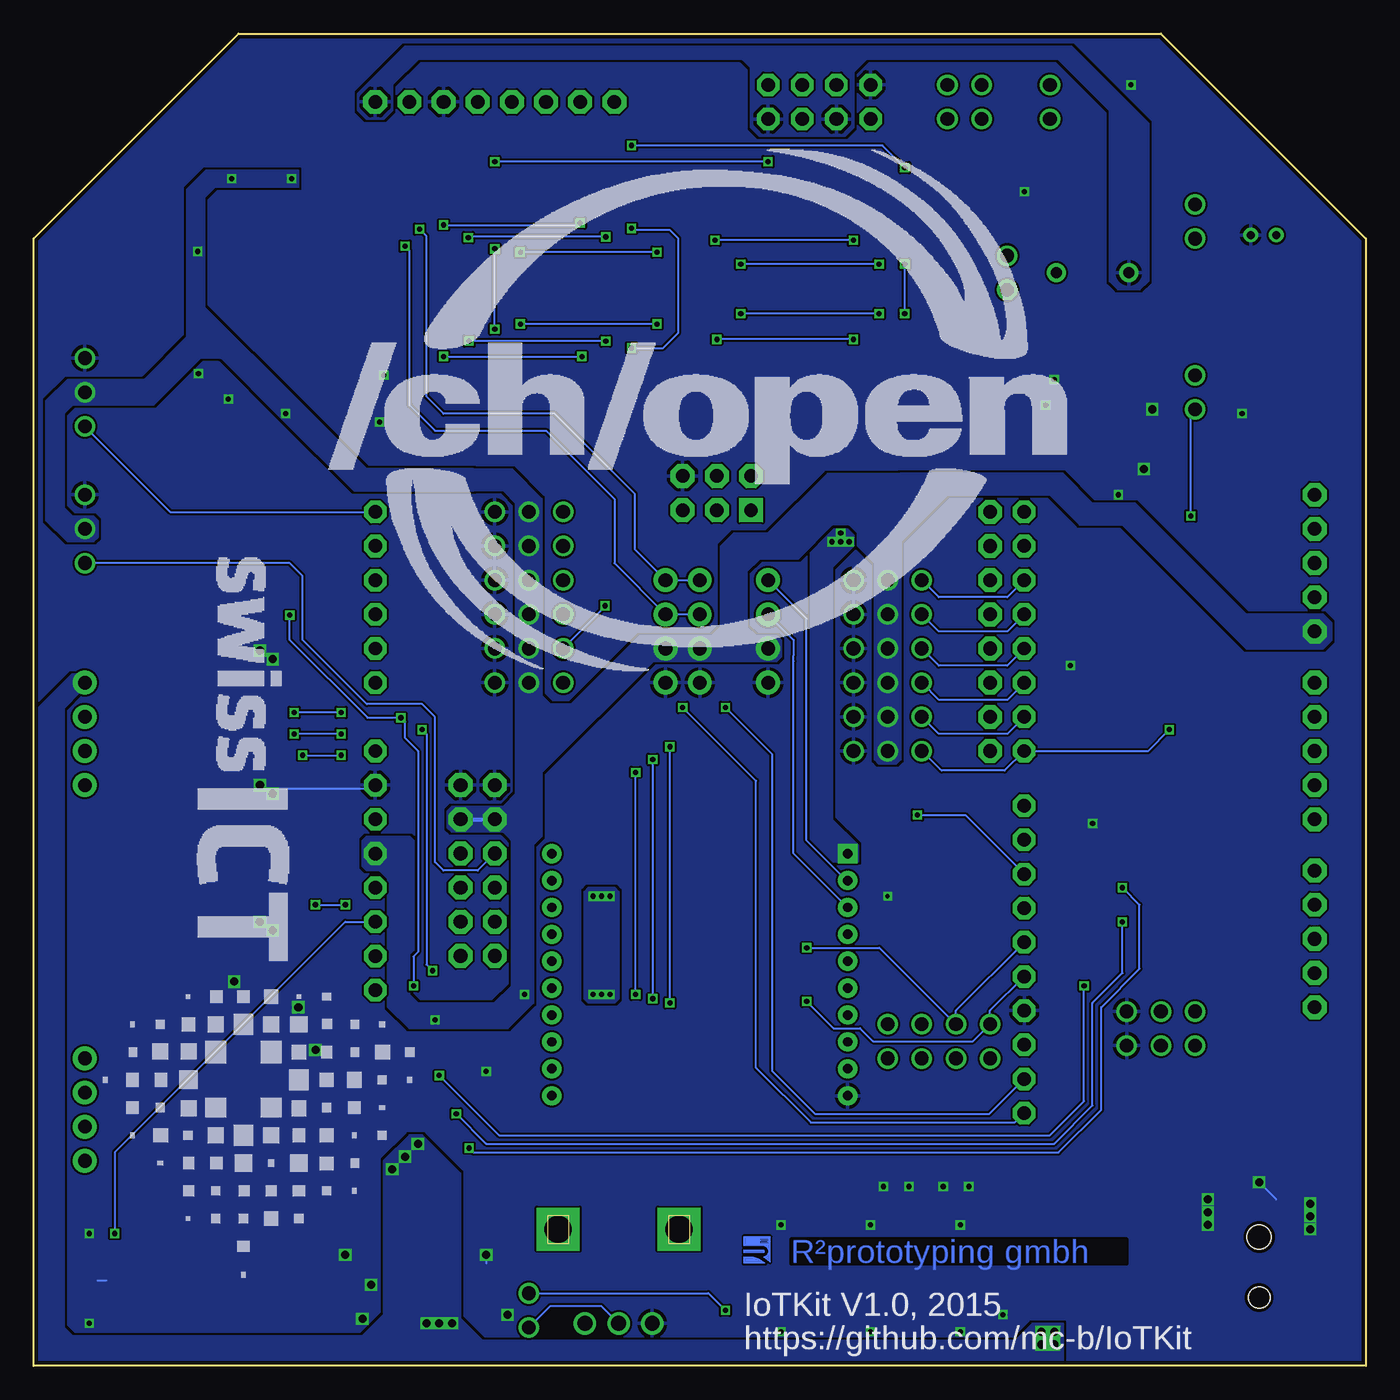
[diagram p4: board, bottom side, seen from below]

Size 99.06 x 99.06 mm. Coordinates in mm from the lower left corner, seen from the top.
Outline: 0,0 99.06,0 99.06,83.82 83.82,99.06 15.24,99.06 0,83.82 0,0
Copper layers (1*16): Top 0.035mm / dielectric 1.5mm / Bottom 0.035mm
Design rules "SeeedStudio_2layer_DRU_no_angle_20140221": minimum track width 6mil, minimum drill 12mil, track to track 6mil, track to pad 6mil, pad to pad 6mil, via to via 6mil, smd to smd 0mil, copper to edge 10mil, drill to drill 10mil, minimum pad ring 10mil, minimum via ring 6mil, stop-mask expansion 2mil, vias tented up to drill 100mil, thermal gap 10mil

### Footprints (pad centres in the part's own frame; a part is rotated, then mirrored left to right if it is on the bottom)
SO24 = smd 0.6 x 2.2: 1 -6.985,-4.6; 2 -5.715,-4.6; 3 -4.445,-4.6; 4 -3.175,-4.6; 5 -1.905,-4.6; 6 -0.635,-4.6; 7 0.635,-4.6; 8 1.905,-4.6; 9 3.175,-4.6; 10 4.445,-4.6; 11 5.715,-4.6; 12 6.985,-4.6; 13 6.985,4.6; 14 5.715,4.6; 15 4.445,4.6; 16 3.175,4.6; 17 1.905,4.6; 18 0.635,4.6; 19 -0.635,4.6; 20 -1.905,4.6; 21 -3.175,4.6; 22 -4.445,4.6; 23 -5.715,4.6; 24 -6.985,4.6
1X02_LINE = drill 1.016: 1 0,0; 2 2.54,0
1X03_LINE = drill 1.016: 1 -2.54,0; 2 0,0; 3 2.54,0
EVQ-Q2 = smd 3.2 x 1.2: A -3.4,-2; A' 3.4,-2; B -3.4,2; B' 3.4,2
0402-CAP = smd 0.7 x 0.9: 1 -0.65,0; 2 0.65,0
C0603K = smd 1.05 x 1.08: 1 -0.875,0; 2 0.875,0
NIPPON_F80 = smd 2.95 x 1: + 2.4,0; - -2.4,0
C0805K = smd 1.1 x 1.4: 1 -1,0; 2 1,0
C0603 = smd 1.1 x 1: 1 -0.85,0; 2 0.85,0
DCJACK_2MM_SMT = smd 2.4 x 2: GND 0,-5.5; GNDBREAK 6.2,-5.5; PWR1 0,5.5; PWR2 6.2,5.5 | hole 1.6: 0,0 | hole 1.8: 4.5,0
1X08-CLEANBIG = drill 1.016 pad 1.778 octagon: 1 -8.89,0; 2 -6.35,0; 3 -3.81,0; 4 -1.27,0; 5 1.27,0; 6 3.81,0; 7 6.35,0; 8 8.89,0
SMA-DIODE = smd 1.27 x 1.47: A -2.15,0; C 2.15,0
1X04_LINE = drill 1.016 pad 1.778: 1 -3.81,0; 2 -1.27,0; 3 1.27,0; 4 3.81,0
2X04 = drill 1.016 pad 1.676 octagon: 1 -3.81,-1.27; 2 -3.81,1.27; 3 -1.27,-1.27; 4 -1.27,1.27; 5 1.27,-1.27; 6 1.27,1.27; 7 3.81,-1.27; 8 3.81,1.27
SOT23-W = smd 1.2 x 1.4: 1 -1.1,-1.3; 2 1.1,-1.3 | smd 1.8 x 1.2: 3 0,1.3
SO18W = smd 0.66 x 2.032: 1 -5.08,-5.029; 2 -3.81,-5.029; 3 -2.54,-5.029; 4 -1.27,-5.029; 5 0,-5.029; 6 1.27,-5.029; 7 2.54,-5.029; 8 3.81,-5.029; 9 5.08,-5.029; 10 5.08,5.029; 11 3.81,5.029; 12 2.54,5.029; 13 1.27,5.029; 14 0,5.029; 15 -1.27,5.029; 16 -2.54,5.029; 17 -3.81,5.029; 18 -5.08,5.029
TO252 = smd 1 x 1.6: 1 -2.28,-4.8; 2 2.28,-4.8 | smd 5.4 x 6.2: 3 0,2.5
CHIP-LED0603 = smd 0.8 x 0.8: A 0,-0.75; C 0,0.75
WM-62PC/62PK = drill 0.6 pad 1: 1 -1,0.95; 2 -1,-0.95
EVUF = drill 1.1 pad 1.676: 1 -2.5,-7; 2 0,-7; 3 2.5,-7 | drill 2 pad 3.2 square: M1 4.5,0; M2 -4.5,0
CHIP-LED0805 = smd 1.2 x 1.2: A 0,-1.05; C 0,1.05
D-PAK_TO252AA = smd 1 x 1.6: 1 -2.28,-4.8; 3 2.28,-4.8 | smd 5.4 x 6.2: 4 0,2.5
SOT23 = smd 1 x 1.4: 1 -0.95,-1.1; 2 0.95,-1.1; 3 0,1.1
R0805 = smd 1.1 x 1.4: 1 -1,0; 2 1,0
R0805' = smd 1.3 x 1.5: 1 -0.95,0; 2 0.95,0
R0603 = smd 1 x 1.1: 1 -0.85,0; 2 0.85,0
1X08-BIG = drill 1.016 pad 1.778 octagon: 1 -8.89,0; 2 -6.35,0; 3 -3.81,0; 4 -1.27,0; 5 1.27,0; 6 3.81,0; 7 6.35,0; 8 8.89,0
TO-5_V10 = drill 0.8 pad 1.4: 1 -2.7,0; 2 2.7,0
7SEG-7 = smd 1.5 x 2.6: 1 -3.8,-7.15; 2 -1.9,-7.15; 3 0,-7.15; 4 1.9,-7.15; 5 3.8,-7.15; 6 3.8,7.15; 7 1.9,7.15; 8 0,7.15; 9 -1.9,7.15; 10 -3.8,7.15
1X03 = drill 1.016: 1 -2.54,0; 2 0,0; 3 2.54,0
1X06-BIG = drill 1.016 pad 1.778 octagon: 1 -6.35,0; 2 -3.81,0; 3 -1.27,0; 4 1.27,0; 5 3.81,0; 6 6.35,0
SMT-0540-S-R = smd 1 x 1: + 1.7,-2.7; - 1.7,2.7; M -1.7,-2.7
1X05 = drill 1.016 pad 1.778 octagon: 1 -5.08,0; 2 -2.54,0; 3 0,0; 4 2.54,0; 5 5.08,0
SOT223 = smd 1.219 x 2.235: 1 -2.311,-3.099; 2 0,-3.099; 3 2.311,-3.099 | smd 3.6 x 2.2: 4 0,3.099
MSOP8 = smd 0.45 x 1: 1 -0.975,-2.05; 2 -0.325,-2.05; 3 0.325,-2.05; 4 0.975,-2.05; 5 0.975,2.05; 6 0.325,2.05; 7 -0.325,2.05; 8 -0.975,2.05
POWERSO20 = smd 1.651 x 0.635: P$1 -6.731,5.715; P$2 -6.731,4.445; P$3 -6.731,3.175; P$4 -6.731,1.905; P$5 -6.731,0.635; P$6 -6.731,-0.635; P$7 -6.731,-1.905; P$8 -6.731,-3.175; P$9 -6.731,-4.445; P$10 -6.731,-5.715; P$11 6.731,-5.715; P$12 6.731,-4.445; P$13 6.731,-3.175; P$14 6.731,-1.905; P$15 6.731,-0.635; P$16 6.731,0.635; P$17 6.731,1.905; P$18 6.731,3.175; P$19 6.731,4.445; P$20 6.731,5.715
FIDUCIAL_1MM = smd 1 x 1: 1 0,0
ARDUINOR3_ICSP_NODIM = drill 1 pad 1.676 octagon: 3V 35.56,2.54; 5V 38.1,2.54; A0 50.8,2.54; A1 53.34,2.54; A2 55.88,2.54; A3 58.42,2.54; A4 60.96,2.54; A5 63.5,2.54; AREF 23.876,50.8; D0 63.5,50.8; D1 60.96,50.8; D2 58.42,50.8; D3 55.88,50.8; D4 53.34,50.8; D5 50.8,50.8; D6 48.26,50.8; D7 45.72,50.8; D8 41.656,50.8; D9 39.116,50.8; D10 36.576,50.8; D11 34.036,50.8; D12 31.496,50.8; D13 28.956,50.8; GND 26.416,50.8; GND@1 43.18,2.54; GND@2 40.64,2.54; IOREF 30.48,2.54; RESERVED 27.94,2.54; RESET 33.02,2.54; SCL 18.796,50.8; SDA 21.336,50.8; VIN 45.72,2.54 | drill 1 pad 1.778 octagon: 5V_ICSP 66.167,30.48; GND@3 66.167,25.4; MOSI 66.167,27.94; RESET_ICSP 63.627,25.4; SCK 63.627,27.94 | drill 1 pad 1.778 square: MISO 63.627,30.48
XBEE = drill 0.7 pad 1.422 square: 1 -11,5.5 | drill 0.7 pad 1.422: 2 -11,3.5; 3 -11,1.5; 4 -11,-0.5; 5 -11,-2.5; 6 -11,-4.5; 7 -11,-6.5; 8 -11,-8.5; 9 -11,-10.5; 10 -11,-12.5; 11 11,-12.5; 12 11,-10.5; 13 11,-8.5; 14 11,-6.5; 15 11,-4.5; 16 11,-2.5; 17 11,-0.5; 18 11,1.5; 19 11,3.5; 20 11,5.5

### Placement (x,y rotation side)
7SEG(0X70)  80.01,80.01 0 top
(A2)  28.57,95.25 270 top
(A3)  31.11,95.25 270 top
A0  62.23,50.8 180 top
A1  62.23,53.34 180 top
A2  62.23,55.88 180 top
A3  62.23,58.42 180 top
A4  62.23,60.96 180 top
A5  62.23,63.5 180 top
BUT1(A0)  44.45,6.35 270 top
BUT2(A1)  37.78,6.35 270 top
BUT3(A2)  31.11,6.35 270 top
C1  67.75,25.72 180 top
C2  7.3,24.77 270 top
C3  71.18,4.76 180 top
C4  83.5,71.12 90 top
C5  15.56,67.94 0 top
C6  35.56,36.83 270 top
C7  17.2,72.07 270 top
C8  76.71,25.4 0 top
C9  25.72,2.86 90 top
C11  65.41,4.76 270 top
C12  74.3,71.12 270 top
C13  84.84,52.07 180 top
C14  85.09,41.91 180 top
C15  85.09,31.75 180 top
C16  7.62,81.28 180 top
C17  17.78,17.14 180 top
CN1  7.94,5.08 90 top
D0-7  27.94,54.61 270 top
D1  81.92,19.05 270 top
D2  81.92,25.4 270 top
D3  85.72,19.05 270 top
D4  85.72,25.4 270 top
D5  85.72,11.43 90 top
D6  85.72,5.08 90 top
D7  81.92,11.43 90 top
D8  81.92,5.08 90 top
DCMOT(D2-D7)  95.25,19.05 90 top
DIO2  35.56,58.42 180 top
DIO3  35.56,55.88 180 top
DIO4  35.56,53.34 180 top
DIO5  35.56,50.8 180 top
DIO6  35.56,48.26 180 top
DIO7  35.56,45.72 180 top
ESP8266  40.64,93.98 180 top
FET(D5-D7)  95.25,46.99 270 top
FUNK(D9)  95.25,62.23 270 top
HALL(A2)  19.05,93.98 0 top
I2C-1  49.53,54.61 90 top
I2C-2  52.07,54.61 90 top
IC1  15.24,34.29 90 top
IC2  15.24,46.99 90 top
IC3  15.24,59.69 90 top
IC4  6.99,19.37 90 top
IR(A5)  95.25,72.39 270 top
JP3  26.67,82.55 270 top
JP4  23.5,95.25 270 top
JP5  12.7,86.36 270 top
JP6  62.23,2.86 90 top
JP7  12.7,71.12 90 top
JP8  27.94,22.86 90 top
JP9  30.48,22.86 90 top
JP10  33.02,22.86 90 top
JP11  35.56,22.86 90 top
LED1  34.92,13.97 180 top
LED2  33.02,13.97 180 top
LED3  30.48,13.97 180 top
LED4  28.57,13.97 180 top
MIC(A3)  7.62,85.09 90 top
POT(A0)  55.56,10.16 0 top
PWR_LED  25.72,7.62 0 top
Q1  19.68,6.99 180 top
Q2  83.31,89.41 180 top
Q5  78.74,89.41 180 top
R5  25.72,11.43 180 top
R8  10k  [R0805']  88.9,52.07 0 top
R9  26.67,86.36 270 top
R10  10k  [R0805']  88.9,41.91 0 top
R11  10k  [R0805']  88.9,31.75 0 top
R12  7.62,79.38 0 top
R16  34.92,19.05 90 top
R17  33.02,19.05 90 top
R18  30.48,19.05 90 top
R19  28.57,19.05 90 top
RESET  93.98,6.35 90 top
RFID(SPI)  64.77,93.98 180 top
RTC(A1)  20.32,81.28 0 top
SEG1  64.77,80.01 0 top
SEG2  54.61,80.01 0 top
SEG3  44.45,80.01 0 top
SEG4  34.29,80.01 0 top
SERIAL  44.45,54.61 90 top
SERVO1(D10)  15.24,23.81 180 top
SERVO2  15.24,26.35 180 top
SPI-1  67.31,36.83 270 top
SPI-2  64.77,36.83 270 top
SPK  7.62,72.39 0 top
STEPPER1  3.81,31.75 90 top
STEPPER2  3.81,45.72 90 top
STEPPER3  3.81,59.69 90 top
T1  85.09,57.15 270 top
T2  85.09,36.83 270 top
T4  85.09,46.99 270 top
TEMP(0X48)  22.86,72.39 0 top
U2  71.25,16.51 270 top
U$1  89.22,2.54 0 top
U$2  97.16,82.55 0 top
U$3  1.91,82.55 0 top
U$4  [R2_2MM]  46.27,7.62 0 bottom
U$5  76.2,0 90 top
U$6  1.91,1.91 0 top
XBEE(SERIAL)  49.53,32.59 0 top

### Tracks (layer width: path | path; a pad name or v marks a point on that pad's centre or on a via)
+3V3  (via drill 0.38)
  Top 0.152: 38.54,38.1 XBEE(SERIAL).1 38.52,38.1 | HALL(A2).1 17.95,92.88
  Top 0.305: 16.51,77.47 10.38,77.47 R12.2
  other vias: 56.2,27.62 56.2,34.92 39.05,61.91 56.83,34.92 57.47,34.92 56.83,27.62 57.47,27.62 39.69,61.28 38.42,61.28 39.05,61.28
  pour Top (no thermals): 35.24,38.73 40.32,38.73 43.18,35.88 61.28,35.88 62.87,37.47 73.98,37.47 74.61,36.83 74.61,34.92 74.3,34.61 68.9,34.61 67.31,36.2 64.45,36.2 62.55,34.29 42.55,34.29 39.37,37.47 35.24,37.47
  pour Bottom (no thermals): 57.78,35.56 55.88,35.56 55.56,35.24 55.56,27.3 55.88,26.99 57.78,26.99 58.1,27.3 58.1,35.24
  pour Top (no thermals): 55.88,28.26 55.56,27.94 55.56,6.67 57.15,5.08 57.15,2.54 57.47,2.22 58.74,2.22 59.05,2.54 59.05,6.99 58.1,7.94 58.1,27.94 57.78,28.26
  pour Bottom (rank 2, no thermals): 38.1,62.23 38.1,60.96 39.69,59.37 39.69,40.64 37.78,38.73 37.78,37.47 39.69,37.47 41.27,39.05 41.27,60.64 39.69,62.23
  pour Top (rank 2): 32.38,60.96 40.01,60.96 40.01,61.91 39.69,62.23 33.02,62.23 28.57,66.67 22.23,66.67 20,68.9 20,71.75 21.91,73.66 21.91,75.25 19.37,77.79 19.37,92.39 19.05,92.71 16.83,92.71 16.51,92.39 16.51,77.79 16.19,77.47 16.19,72.39 16.51,72.07 18.1,72.07 18.41,71.75 18.41,68.26 21.27,65.41 27.94,65.41
  pour Bottom (rank 2): 16.19,92.39 16.19,80.64 16.83,80.01 18.41,80.01 19.05,80.64 19.05,93.34 22.86,97.16 37.15,97.16 38.1,96.2 38.1,92.08 38.73,91.44 45.09,91.44 45.72,92.08 45.72,96.52 46.35,97.16 70.48,97.16 72.39,95.25 72.39,93.34 73.03,92.71 74.3,92.71 74.93,93.34 74.93,94.61 71.44,98.11 21.91,98.11
+5V  (via drill 0.38)
  Top 0.152: 87.12,84.74 7SEG(0X70).13 | 83.4,88.39 Q2.3 84.28,88.31 v84.33,88.27 | C11.1 65.41,6.03 | v79.88,88.27 79.84,88.31 Q5.3
  Top 0.305: 7SEG(0X70).13 87,82.68 v86.87,82.87 | v62.55,27.62 62.55,15.56 66.8,11.3 U2.P$12 66.8,7.16 C11.1 | C4.1 80.89,70.25 v80.33,70.8 | C1.1 v69.22,25.72 | IC3.10 10.21,66.99 11.19,67.94 C5.1
  Bottom 0.305: SPI-1.2 SPI-2.2
  pour Top (rank 2, no thermals): 0.64,67.94 0,67.31 0,25.08 9.21,25.08 9.84,24.45 9.84,22.86 14.29,18.41 14.29,16.83 15.56,16.83 15.56,18.41 11.43,22.54 11.43,24.13 12.06,24.77 13.65,24.77 14.92,23.5 15.88,23.5 15.88,26.67 14.92,26.67 13.65,25.4 12.06,25.4 8.89,28.57 3.17,28.57 2.54,29.21 2.54,37.15 3.17,37.78 3.81,37.78 4.76,38.73 11.11,38.73 11.11,41.27 4.13,41.27 2.54,42.86 2.54,50.48 3.49,51.44 11.11,51.44 11.11,53.98 6.03,53.98 3.49,56.52 3.17,56.52 2.54,57.15 2.54,64.77 3.81,66.04 4.13,66.04 6.03,64.14 11.11,64.14 11.11,66.67 9.84,67.94
  pour Bottom (no thermals): 34.61,66.36 34.61,45.09 34.92,44.77 36.2,44.77 36.51,45.09 36.51,59.69 37.78,60.96 37.78,61.91 38.42,62.55 39.69,62.55 42.23,60.01 45.09,60.01 46.04,59.05 46.04,54.93 45.4,54.29 43.81,54.29 43.5,53.98 43.5,52.7 43.81,52.39 53.02,52.39 61.28,44.13 61.28,39.37 61.91,38.73 61.91,38.42 63.18,38.73 64.14,39.69 67.94,39.69 68.26,40.01 68.26,41.27 67.94,41.59 64.14,41.59 63.18,42.55 63.18,64.14 64.14,65.09 66.36,65.09 66.36,66.67 63.5,66.67 61.28,64.45 61.28,49.85 60.64,49.21 59.05,49.21 53.98,54.29 48.58,54.29 47.94,54.93 47.94,60.96 46.99,61.91 44.45,61.91 40.01,66.36
  pour Bottom (no thermals): 61.91,42.23 61.91,26.99 63.82,25.08 71.12,25.08 72.71,26.67 72.71,36.2 73.34,36.83 74.3,36.83 74.61,37.15 74.61,39.05 74.3,39.37 71.12,39.37 70.8,39.05 70.8,30.92 71.13,30.59 71.13,27.62 70.5,26.99 64.77,26.99 63.5,28.26 63.5,42.23
  pour Bottom (no thermals): 87.63,76.52 87.63,87.5 86.23,88.9 79.38,88.9 79.38,87.63 85.6,87.63 86.36,86.87 86.36,78.74 79.38,71.75 80.64,70.48 85.09,74.93 86.68,74.93 90.17,71.44 94.93,71.44 94.93,73.34 90.81,73.34
  pour Bottom (no thermals): 66.36,66.67 74.3,66.67 79.38,71.75 80.64,70.48 75.25,65.09 66.36,65.09
  pour Bottom (no thermals): 2.54,55.24 3.17,55.88 8.89,55.88 17.14,64.14 20.32,64.14 22.54,66.36 34.61,66.36 34.61,61.28 31.11,64.77 23.5,64.77 21.27,62.55 18.1,62.55 8.89,53.34 3.17,53.34 2.54,53.98
  pour Bottom (no thermals): 96.2,71.44 96.84,70.8 96.84,63.82 96.2,63.18 94.61,63.18 94.3,62.87 94.3,61.59 94.61,61.28 96.52,61.28 98.11,62.87 98.11,71.75 96.52,73.34 94.93,73.34 94.93,71.44
+12V  (via drill 0.6)
  Top 0.152: 21.77,6.57 20.14,4.94 Q1.4 | IC4.1 11.8,17.09
  Top 0.305: PWR_LED.A 21.77,6.57
  Top 0.406: C8.1 71.25,25.4 70.61,24.77 U2.P$6 | 19.68,5.4 20.14,4.94
  other vias: 24.13,2.54 24.13,1.59 23.18,1.59 23.18,2.54 67.94,3.17 68.9,3.17 69.85,3.17 70.48,16.51 71.44,15.56 72.39,14.61
  pour Bottom (no thermals): 22.54,3.17 22.54,0 99.06,0 99.06,48.58 96.2,51.44 94.93,51.44 94.93,50.16 95.57,50.16 96.84,48.9 96.84,2.86 96.2,2.22 71.75,2.22 70.48,3.49 67.31,3.49 65.72,1.91 26.04,1.91 24.77,3.17
  pour Bottom (no thermals): 67.31,2.86 67.31,14.29 70.17,17.14 71.12,17.14 73.03,15.24 73.03,13.97 73.03,3.81 74.61,2.22 74.61,0.95 69.22,0.95
  pour Top (no thermals): 69.85,24.13 69.85,15.88 71.75,13.97 73.03,13.97 73.03,17.78 71.12,19.68 71.12,24.13
  pour Top (no thermals): 72.71,17.78 86.36,17.78 86.68,17.46 86.68,13.18 86.2,12.7 80.64,12.7 79.69,13.65 72.07,13.65 71.44,14.29 71.44,16.51
  pour Top (no thermals): 67.31,5.4 70.48,5.4 70.48,2.86 70.17,2.54 67.63,2.54 67.31,2.86
  pour Top (no thermals): 16.83,7.94 22.23,7.94 22.86,7.3 22.86,4.76 24.77,2.86 26.04,2.86 26.35,2.54 26.35,0.32 26.35,0 16.83,0
  pour Top (no thermals): 11.11,17.46 11.11,16.83 14.61,13.34 17.78,13.34 18.73,12.38 18.73,5.08 20,4.76 20,12.7 18.41,14.29 15.24,14.29 12.06,17.46
/RST  (via drill 0.38)
  Top 0.152: RESET.B RESET.B' 92.94,9.75 v93.03,9.84
  Bottom 0.152: U$5.RESET 75.88,33.02 93.03,15.88 v93.03,9.84
A0  (via drill 0.38)
  Top 0.152: BUT1(A0).B' 46.45,4.13 | 46.45,4.13 46.45,9.21 BUT1(A0).B 46.45,17.56 54.29,25.4 v54.29,27.62 | U$5.A0 72.45,49.59 60.9,49.59 A0.3 54.29,45.4 v54.29,44.13 | v47.62,4.13 46.45,4.13
  Bottom 0.152: v54.29,27.62 v54.29,44.13 | JP6.2 48.9,5.4 v47.62,4.13
A1  (via drill 0.38)
  Top 0.152: U$5.A1 72.39,52.07 60.96,52.07 A1.3 53.02,46.67 v53.02,45.09 53.02,45.4 | BUT2(A1).B' BUT2(A1).B 39.78,12.79 53.02,26.04 v53.02,27.3 | JP3.2 26.67,71.75 33.66,64.77 40.01,64.77 43.81,60.96 52.13,60.96 v56.58,56.52
  Bottom 0.152: v53.02,27.3 v53.02,45.09 | A1.3 56.9,56.13 v56.58,56.52
A2  (via drill 0.38)
  Top 0.152: U$5.A2 72.39,54.61 60.96,54.61 A2.3 | BUT3(A2).B' BUT3(A2).B 33.12,11.21 33.97,12.06 37.15,12.06 51.75,26.67 v51.75,26.99 | v51.75,46.04 51.75,47.94 A2.3 | JP4.2 (A2).2 27.94,92.08 27.94,71.44 33.97,65.41 40.32,65.41 44.13,61.59 53.98,61.59 A2.3
  Bottom 0.152: v51.75,26.99 v51.75,46.04
A2ESP
  Top 0.152: ESP8266.1 42.86,96.84 30.16,96.84 (A2).1
A3
  Top 0.152: U$5.A3 72.39,57.15 60.96,57.15 A3.3 57.78,60.33 57.78,62.23 51.56,68.45 31.88,68.45 28.89,71.44 28.89,90.49 (A3).2 29.84,93.98 27.3,93.98 24.45,96.84 17.14,96.84 12.7,92.39 JP5.1
A3ESP
  Top 0.152: ESP8266.8 33.66,92.71 (A3).1
A4
  Top 0.152: U$5.A4 72.39,59.69 60.96,59.69 A4.3
A5
  Top 0.152: U$5.A5 72.39,62.23 60.96,62.23 A5.3
  Bottom 0.152: IR(A5).3 88.9,63.5 U$5.A5
A_1  (via drill 0.38)
  Top 0.152: 7SEG(0X70).21 76.83,82.8 76.58,82.55 68.07,82.55 v66.74,83.88 66.67,83.95 SEG1.7 | SEG2.7 v56.51,83.95 v56.52,83.95
  Bottom 0.152: v56.52,83.95 66.67,83.95 v66.74,83.88
A_2  (via drill 0.38)
  Top 0.152: 7SEG(0X70).17 81.92,81.28 81.66,81.03 47.37,81.03 v46.48,81.92 46.48,87.03 SEG3.7 | SEG4.7 36.19,85.22 v36.2,81.92
  Bottom 0.152: v36.2,81.92 v46.48,81.92
B_1  (via drill 0.38)
  Top 0.152: 7SEG(0X70).22 75.56,86.36 74.68,87.25 68.66,87.25 SEG1.6 v68.57,84.85 v68.58,84.84 | v58.42,84.96 SEG2.6
  Bottom 0.152: v68.58,84.84 58.55,84.84 v58.42,84.96
B_2  (via drill 0.38)
  Top 0.152: SEG3.6 48.39,87.02 v48.39,83.69 50.67,81.41 80.39,81.41 80.64,81.66 7SEG(0X70).18 | SEG4.6 38.09,83.7 v38.1,83.69
  Bottom 0.152: v38.1,83.69 v48.39,83.69
C_1  (via drill 0.38)
  Top 0.152: 7SEG(0X70).4 76.83,77.34 76.58,77.6 68.07,77.6 v66.67,76.2 SEG1.4 | SEG2.4 v56.51,76.19 v56.52,76.2
  Bottom 0.152: v56.52,76.2 v66.67,76.2
C_2  (via drill 0.38)
  Top 0.152: SEG3.4 46.48,72.99 v46.48,78.23 47.37,79.12 81.53,79.12 81.92,78.74 7SEG(0X70).8 | SEG4.4 36.19,74.54 v36.2,78.23
  Bottom 0.152: v36.2,78.23 v46.48,78.23
D0
  Top 0.152: U$5.D0 25.91,63.5 27.18,62.23 30.23,62.23 32.13,60.33 41.27,60.33 43.18,58.42 SERIAL.4
  Bottom 0.152: XBEE(SERIAL).2 38.63,36.09 41.59,39.05 41.59,55.56 SERIAL.4
D1
  Top 0.152: SERIAL.3 40.64,59.69 26.67,59.69 U$5.D1
  Bottom 0.152: XBEE(SERIAL).3 42.55,38.1 42.55,52.39 42.55,52.83 42.55,53.98 SERIAL.3
D2  (via drill 0.38)
  Top 0.152: IC1.1 IC1.2 18.1,30.48 16.19,32.38 16.19,57.59 17.65,59.05 24.77,59.05 U$5.D2 | U2.P$7 69.34,22.04 v68.9,21.59 | 20.32,29.16 IC1.1 | v20.95,28.26 20.95,28.52 IC1.1
  Bottom 0.152: U$5.D2 26.67,57.15 31.75,57.15 DIO2.3 | v20.95,28.26 20.95,19.68 23.5,17.14 64.45,17.14 v68.9,21.59
D3  (via drill 0.38)
  Top 0.152: IC1.3 IC1.4 v18.1,33.02 16.83,34.29 16.83,55.75 17.59,56.52 24.77,56.52 U$5.D3 | U2.P$8 68.07,19.18 v67.63,18.73
  Bottom 0.152: U$5.D3 26.67,54.61 31.75,54.61 DIO3.3 | v18.1,33.02 18.1,29.21 20.32,26.99 20.32,19.37 23.18,16.51 65.41,16.51 v67.63,18.73
D4  (via drill 0.38)
  Top 0.152: IC1.5 IC1.6 v18.1,35.56 17.46,36.2 17.46,52.7 18.1,53.34 U$5.D4 | U2.P$9 66.8,16.32 v66.67,16.19
  Bottom 0.152: U$5.D4 26.67,52.07 31.75,52.07 DIO4.3 | v18.1,35.56 16.83,34.29 16.83,29.53 19.68,26.67 19.68,19.05 22.86,15.88 66.36,15.88 v66.67,16.19
D5  (via drill 0.38)
  Top 0.152: IC1.7 IC1.8 18.73,38.1 18.1,38.73 18.1,48.26 18.73,48.9 22.54,48.9 24.45,50.8 U$5.D5 | DIO5.3 34.29,49.53 39.37,49.53 46.35,42.55 57.78,42.55 63.5,48.26 71.69,48.26 v71.75,48.2 | 81.97,59.44 T1.1 81.68,59.15 81.46,59.37 80.64,59.37 80.01,58.74 v80.01,55.82 | v70.81,28.26 70.19,27.64 65.42,27.64 63.82,26.04 63.82,16.51 69.34,10.99 U2.P$14
  Bottom 0.152: U$5.D5 26.67,49.53 31.75,49.53 DIO5.3 | v70.81,28.26 70.81,30.44 70.48,30.77 70.48,45.72 71.44,46.67 71.44,47.88 v71.75,48.2 74.23,48.2 80.01,53.98 v80.01,55.82
D6  (via drill 0.38)
  Top 0.152: DIO6.3 34.29,46.99 38.73,46.99 43.81,41.91 58.42,41.91 63.82,47.31 v70.17,47.31 72.07,47.31 72.39,47.62 75.25,47.62 v76.2,48.58 | v69.39,29.39 68.58,28.57 65.41,28.57 63.18,26.35 63.18,16.19 68.07,11.3 U2.P$13 | 81.9,49.21 T4.1 81.97,49.28 81.28,49.28 81.22,49.21 80.33,49.21 v79.69,48.58
  Bottom 0.152: U$5.D6 26.67,46.99 31.75,46.99 DIO6.3 | v76.2,48.58 v79.69,48.58 | v70.17,47.31 69.85,46.99 69.85,29.84 v69.39,29.39
D7  (via drill 0.38)
  Top 0.152: 81.28,39.37 81.76,39.37 T2.1 80.01,39.14 | v79.69,46.99 80.01,46.67 80.01,39.14 | v76.2,46.99 72.71,46.99 72.07,46.35 64.14,46.35 59.05,41.27 37.47,41.27 DIO7.3 | 80.01,39.14 80.01,32.38 74.3,26.67 65.41,26.67 64.45,25.72 64.45,16.83 70.61,10.67 U2.P$15 | v13.02,63.18 13.02,48.9 v14.61,47.31
  Bottom 0.152: DIO7.3 31.56,44.26 26.86,44.26 U$5.D7 16.19,45.72 v14.61,47.31 | v76.2,46.99 v79.69,46.99 | v13.02,63.18 13.02,70.8 JP7.1
D8
  Top 0.152: U$5.D8 27.05,40.01 61.91,40.01 62.55,39.37 66.04,39.37 SPI-1.3 70.8,38.1 72.07,39.37 74.93,39.37 77.47,41.91 77.47,61.28 88.9,72.71 88.9,89.22 82.23,95.89 73.03,95.89 RFID(SPI).2
D9
  Top 0.152: SPI-2.3 62.87,38.1 61.59,39.37 25.65,39.37 U$5.D9 22.23,35.94 22.23,27.94 21.27,26.99 19.37,26.99 18.41,27.94 14.29,27.94 SERVO2.3
  Bottom 0.152: SPI-2.3 66.04,36.83 68.58,36.83 69.22,37.47 69.22,48.26 70.17,49.21 74.3,49.21 79.06,53.98 79.06,58.74 80.01,59.69 FUNK(D9).3
D10  (via drill 0.38)
  Top 0.152: RFID(SPI).8 59.05,97.16 83.5,97.16 90.17,90.49 90.17,71.44 78.74,60.01 78.74,45.72 v79.06,45.4 | v76.2,45.4 75.25,44.45 72.07,44.45 71.12,45.4 64.45,45.4 59.69,40.64 33.66,40.64 v33.34,40.96 | SERVO1(D10).3 14.92,21.59 18.1,21.59 19.68,23.18 19.68,24.77 22.86,27.94 22.86,34.04 U$5.D10 31.69,36.58 35.56,32.7 JP11.2
  Bottom 0.152: v79.06,45.4 v76.2,45.4 | v33.34,40.96 29.78,40.96 U$5.D10
D11  (via drill 0.38)
  Top 0.152: U$5.D11 30.73,34.04 33.02,31.75 JP10.2 34.29,24.13 36.2,24.13 37.15,25.08 37.15,32.38 37.83,33.07 62.28,33.07 SPI-2.4 SPI-1.4 68.58,34.29 v75.88,34.29 | RFID(SPI).6 63.5,96.52 82.87,96.52 89.53,89.85 89.53,72.07 78.11,60.64 v78.11,34.29
  Bottom 0.152: v78.11,34.29 v75.88,34.29
D12  (via drill 0.38)
  Top 0.152: RFID(SPI).5 65.72,96.2 82.55,96.2 89.22,89.53 89.22,72.39 77.79,60.96 77.79,41.59 77.15,40.96 77.15,33.97 74.93,31.75 72.36,31.75 71.09,33.02 SPI-1.5 SPI-2.5 62.84,31.09 v41.58,31.09
  Bottom 0.152: v41.58,31.09 36.17,31.09 JP9.2 30.48,26.42 U$5.D12
D13  (via drill 0.38)
  Top 0.152: RFID(SPI).7 61.28,96.84 83.19,96.84 89.85,90.17 89.85,71.75 78.42,60.33 78.42,41.27 79.38,40.32 79.38,33.34 75.25,29.21 72.39,29.21 71.12,30.48 SPI-1.6 SPI-2.6 63.37,29.08 43.56,29.08 v41.58,27.1
  Bottom 0.152: U$5.D13 27.94,26.42 JP8.2 29.21,24.13 36.65,24.13 37.62,25.09 39.57,25.09 v41.58,27.1
D_1  (via drill 0.38)
  Top 0.152: 7SEG(0X70).5 78.11,77.6 77.72,77.98 63.37,77.98 v62.87,77.47 SEG1.2 | SEG2.2 52.71,77.08 v52.7,77.47
  Bottom 0.152: v52.7,77.47 v62.87,77.47
D_2
  Top 0.152: 7SEG(0X70).9 83.19,79.12 82.8,79.5 45.47,79.5 42.55,76.58 SEG3.2 42.67,72.74 42.67,71.25 41.59,70.17 33.34,70.17 32.39,71.11 SEG4.2
DMX1  (via drill 0.38)
  Top 0.152: v64.77,77.09 SEG1.3 64.77,71.12 63.82,70.17 45.4,70.17 44.45,71.12 SEG3.3 | v64.77,83.06 SEG1.8 v64.77,89.53 65.74,90.51 Q5.2 | SEG3.8 v44.45,89.53
  Bottom 0.152: v64.77,77.09 v64.77,83.06 | v44.45,89.53 v64.77,89.53
DMX2  (via drill 0.38)
  Top 0.152: SEG4.3 v34.29,78.23 | v34.29,81.92 SEG4.8 v34.29,89.09 | SEG2.3 v54.61,75.69 | v54.61,84.58 SEG2.8 v54.61,90.74 55.82,91.95 80.92,91.95 Q2.2
  Bottom 0.152: v34.29,78.23 v34.29,81.92 | v54.61,90.74 35.94,90.74 v34.29,89.09 | v54.61,75.69 52.26,75.69 51.12,76.83 51.12,83.82 51.75,84.45 54.48,84.45 v54.61,84.58
DP_1  (via drill 0.38)
  Top 0.152: 68.66,72.77 SEG1.5 68.57,75.05 v68.58,75.06 68.58,75.95 69.85,77.22 75.18,77.22 75.56,76.83 7SEG(0X70).3 | v58.29,75.06 58.29,72.98 SEG2.5
  Bottom 0.152: v68.58,75.06 v58.29,75.06
DP_2  (via drill 0.38)
  Top 0.152: 48.13,72.98 SEG3.5 v48.26,76.33 50.67,78.74 80.26,78.74 80.64,78.36 7SEG(0X70).7 | SEG4.5 38.09,76.32 v38.1,76.33
  Bottom 0.152: v38.1,76.33 v48.26,76.33
E_1
  Top 0.152: 7SEG(0X70).6 79.38,77.98 78.99,78.36 60.96,78.36 | 60.96,78.36 SEG1.1 | 60.96,78.36 51.69,78.36 50.8,77.47 SEG2.1
E_2
  Top 0.152: 7SEG(0X70).10 84.45,79.5 84.07,79.88 40.64,79.88 | 40.64,79.88 40.64,73 SEG3.1 | 40.64,79.88 32.13,79.88 30.48,78.23 30.48,73.12 SEG4.1
F_1  (via drill 0.38)
  Top 0.152: 7SEG(0X70).20 78.11,82.42 77.85,82.17 63.5,82.17 v62.87,82.8 SEG1.9 | SEG2.9 v52.71,82.81 v52.7,82.8
  Bottom 0.152: v52.7,82.8 v62.87,82.8
F_2
  Top 0.152: 7SEG(0X70).16 83.19,80.9 82.93,80.64 45.47,80.64 42.55,83.57 SEG3.9 42.67,87.28 42.67,89.15 41.53,90.3 33.53,90.3 32.39,89.16 SEG4.9
G_1
  Top 0.152: 7SEG(0X70).19 79.38,82.04 79.12,81.79 60.96,81.79 | 60.96,81.79 SEG1.10 | 60.96,81.79 51.56,81.79 50.93,82.42 50.93,87.04 SEG2.10
G_2
  Top 0.152: 7SEG(0X70).15 84.45,80.64 84.07,80.26 40.64,80.26 | 40.64,80.26 SEG3.10 | 40.64,80.26 32.13,80.26 30.48,81.92 SEG4.10
GND  (via drill 0.3, 0.38, 0.6)
  Top 0.152: 81.92,3.05 D8.A 81.84,2.86 | IC1.9 20.27,40.34 v20.32,40.32 | IC2.9 v21.97,52.07 | SPK.+ 9.32,70.69 v9.21,70.8 | C12.2 74.19,70.17 v73.34,70.17 | IC3.9 v18.41,64.77 | C11.2 65.41,3.49 | 73.03,4.52 C3.- 72.31,6.03 | C11.2 65.67,3.76 65.67,3.81 v63.82,3.81 | U2.P$11 65.53,8.38 v65.41,8.26 | C11.2 65.41,3.81 | 28.84,3.22 29.11,3.49 BUT3(A2).A' 28.8,2.54 v30.16,2.54 | C9.2 25.77,3.81 v26.99,3.81 | 22.1,11.92 Q1.1 | SERVO1(D10).1 SERVO2.1 | 4.76,19.64 IC4.3 | C6.2 v35.56,34.92 | RESET.A' 95.89,9.84 v94.93,9.84 | RESET.A 95.75,3.17 v94.93,3.17 | 7SEG(0X70).1 v73.03,73.66 | 7SEG(0X70).12 87,73.98 v86.81,73.79 | C4.2 84.47,72 v84.58,71.88 | BUT2(A1).A' 36.1,2.54 v36.83,2.54 | BUT1(A0).A' 42.45,2.54 v43.5,2.54 | BUT1(A0).A 42.45,10.48 v43.5,10.48 | BUT2(A1).A 35.78,10.48 v36.83,10.48 | BUT3(A2).A 29.11,10.48 v30.16,10.48 | LED4.C 28.57,13.34 v29.53,13.34 | LED3.C 30.48,13.34 v31.43,13.34 | LED2.C 33.02,13.34 v33.97,13.34 | LED1.C 34.92,13.34 v35.88,13.34 | R9.1 25.5,87.21 v25.4,87.31 | TEMP(0X48).6 TEMP(0X48).7 | TEMP(0X48).5 TEMP(0X48).6 | TEMP(0X48).6 23.18,73.67 v23.18,73.34 | TEMP(0X48).4 23.84,71.42 v23.81,71.44 | HALL(A2).3 19.02,95.25 v17.46,95.25
  Top 0.305: v65.41,21.91 65.53,22.04 U2.P$10 65.53,24.26 66.99,25.72 C1.2 | 16.51,68.02 C5.2 16.51,67.87 v16.51,66.67 | C7.2 17.07,71.12 v15.88,71.12
  Bottom 0.152: 80.77,42.93 73.91,42.93 U$5.GND@1 | 94.3,6.35 93.66,6.35 | v18.41,64.77 18.41,65.09 | v65.41,8.26 65.41,7.62 | v7.94,13.65 6.67,12.38
  other vias: 81.28,52.55 81.28,42.55 81.28,32.38 75.88,8.26 73.98,6.03 74.61,3.49 79.38,26.67 78.11,23.5 84.14,28.57 4.13,12.06 4.13,11.11 4.13,10.16 11.75,12.38 11.75,11.43 11.75,10.48 82.23,53.18 82.23,43.18 82.23,33.02
  pour Bottom (rank 3): 0,0 0,83.82 15.24,99.06 83.82,99.06 99.06,83.82 99.06,0.25 98.81,0
  pour Top (rank 2, no thermals): 80.64,55.24 83.82,55.24 84.45,54.61 84.45,51.44 81.28,51.44 80.64,52.07
  pour Top (rank 2, no thermals): 80.64,45.09 83.82,45.09 84.45,44.45 84.45,41.27 81.28,41.27 80.64,41.91
  pour Top (rank 2, no thermals): 80.64,34.92 83.82,34.92 84.45,34.29 84.45,31.11 81.28,31.11 80.64,31.75
  pour Top (rank 6, no thermals): 72.07,4.13 76.2,0 86.68,0 86.68,10.79 72.07,10.79
  pour Top (rank 6, no thermals): 0,27.62 0,0 26.35,0 26.35,26.99 25.72,27.62
  pour Top (rank 4, no thermals): 80.64,32.38 80.64,29.84 75.25,24.45 75.25,22.23 86.68,22.23 87.31,22.86 87.31,31.75 86.68,32.38
N$2
  pour Top (rank 2, no thermals): 16.51,8.26 19.37,8.26 19.37,12.06 18.41,13.02 14.61,13.02 14.61,3.81 6.03,3.81 3.49,6.35 1.27,6.35 1.27,3.81 2.86,3.81 3.49,3.17 3.49,0 16.51,0
N$3
  Top 0.152: R9.2 JP3.1 25.4,81.28 RTC(A1).2
N$4
  Top 0.152: HALL(A2).2 20.29,92.68 22.86,95.25 JP4.1
N$5
  Top 0.152: C16.1 10.16,81.28 JP5.2
N$7
  Bottom 0.152: POT(A0).2 56.85,4.45 60.64,4.45 JP6.1
N$8
  Top 0.152: JP7.2 11.43,74.93 9.48,74.93 SPK.-
N$9
  Top 0.152: R16.2 34.92,22.23 JP11.1
N$10
  Top 0.152: R17.2 JP10.1
N$11
  Top 0.152: R18.2 JP9.1
N$12
  Top 0.152: R19.2 28.57,22.23 JP8.1
N$20
  Top 0.152: R16.1 LED1.A
N$21
  Top 0.152: R17.1 LED2.A
N$22
  Top 0.152: R18.1 LED3.A
N$23
  Top 0.152: R19.1 LED4.A
N$24
  pour Top (no thermals): 11.11,51.12 4.76,51.12 4.13,51.75 3.49,51.75 3.49,49.85 4.13,49.85 4.76,49.21 11.11,49.21
N$25
  pour Top (no thermals): 11.11,48.58 4.76,48.58 4.13,49.21 3.49,49.21 3.49,47.31 4.13,47.31 4.76,46.67 11.11,46.67
N$26
  pour Top (no thermals): 11.11,46.04 4.76,46.04 4.13,46.67 3.49,46.67 3.49,44.77 4.13,44.77 4.76,44.13 11.11,44.13
N$27
  pour Top (no thermals): 11.11,43.5 4.76,43.5 4.13,44.13 3.49,44.13 3.49,42.23 4.13,42.23 4.76,41.59 11.11,41.59
N$28
  Top 0.152: 85.85,84.48 7SEG(0X70).14 85.72,88.58 84.26,90.05 Q2.1
N$30
  Top 0.152: 85.6,75.54 7SEG(0X70).11 85.72,80.39 85.09,81.03 85.09,86.04 84.45,86.68 82.87,86.68 79.69,89.86 Q5.1
N$33
  Top 0.152: C12.1 7SEG(0X70).2
N$34
  pour Top (rank 2, no thermals): 85.72,52.7 88.27,52.7 88.27,51.44 85.72,51.44
N$35
  pour Top (no thermals): 95.25,48.9 94.93,48.9 93.34,50.48 93.34,55.24 89.53,59.05 81.28,59.05 81.28,55.24 88.9,55.24 89.53,54.61 89.53,50.16 92.08,47.62 95.25,47.62
N$36
  pour Top (rank 2, no thermals): 85.72,42.55 88.27,42.55 88.27,41.27 85.72,41.27
N$37
  Top 0.152: R10.2 89.41,41.91
  pour Top (no thermals): 94.93,46.67 91.76,46.67 89.53,48.9 81.28,48.9 81.28,45.09 88.9,45.09 89.53,44.45 89.53,41.27 90.81,41.27 94.61,45.09 95.25,45.09 95.25,46.35
N$38
  pour Top (rank 2, no thermals): 85.72,32.38 88.27,32.38 88.27,31.11 85.72,31.11
N$39
  pour Top (no thermals): 95.89,40.64 95.89,43.18 95.25,43.81 94.61,43.81 89.53,38.73 81.28,38.73 81.28,34.92 88.9,34.92 89.53,34.29 89.53,31.11 90.81,31.11 93.34,33.66 93.34,38.1
N$40
  Top 0.152: R12.1 C16.2 6.77,83.99 MIC(A3).1
N$41
  pour Top (no thermals): 3.49,35.88 4.13,35.88 4.76,36.51 11.11,36.51 11.11,38.42 4.76,38.42 4.13,37.78 3.49,37.78
N$42
  pour Top (no thermals): 3.49,33.34 4.13,33.34 4.76,33.97 11.11,33.97 11.11,35.88 4.76,35.88 4.13,35.24 3.49,35.24
N$43
  pour Top (no thermals): 3.49,30.8 4.13,30.8 4.76,31.43 11.11,31.43 11.11,33.34 4.76,33.34 4.13,32.7 3.49,32.7
N$44
  pour Top (no thermals): 3.49,30.16 3.49,28.26 4.13,28.26 4.76,28.89 11.11,28.89 11.11,30.8 5.08,30.8 4.45,30.16
N$45
  pour Top (no thermals): 11.11,63.82 6.03,63.82 4.13,65.72 3.49,65.72 3.49,63.82 4.13,63.82 6.03,61.91 11.11,61.91
N$46
  pour Top (no thermals): 11.11,61.28 6.03,61.28 4.13,63.18 3.49,63.18 3.49,61.28 4.13,61.28 6.03,59.37 11.11,59.37
N$47
  pour Top (no thermals): 11.11,58.74 6.03,58.74 4.13,60.64 3.49,60.64 3.49,58.74 4.13,58.74 6.03,56.83 11.11,56.83
N$48
  pour Top (no thermals): 11.11,56.2 6.03,56.2 4.13,58.1 3.49,58.1 3.49,56.2 4.13,56.2 6.03,54.29 11.11,54.29
OUT1
  pour Top (rank 3, no thermals): 72.71,24.13 72.71,20.64 73.34,20 83.19,20 83.82,20.64 83.82,22.86 84.77,22.23 95.25,22.23 95.41,23.65 93.03,26.04 82.55,26.04 78.74,22.23 73.98,22.23 73.98,24.13
OUT2
  pour Top (rank 2, no thermals): 95.25,21.11 95.25,19.37 87.95,19.37 86.68,18.1 73.03,18.1 71.44,19.68 71.44,24.13 72.39,24.13 72.39,20.95 73.34,20 83.19,20 83.82,20.64 83.82,22.86 84.77,23.81 86.68,23.81 88.58,21.91 94.46,21.91
OUT3
  pour Top (rank 5, no thermals): 95.25,14.29 95.25,16.19 91.12,16.19 85.72,10.79 80.64,10.79 79.06,12.38 74.3,12.38 72.71,10.79 72.71,8.89 73.98,8.89 73.98,10.79 77.47,10.79 77.47,8.89 82.23,4.13 87,4.13 91.76,8.89 92.08,11.11
OUT4
  pour Top (rank 4, no thermals): 71.44,8.89 71.44,12.38 73.66,14.61 82.23,14.61 86.36,12.38 92.71,18.73 95.25,18.73 95.25,16.83 93.66,16.83 86.68,9.84 86.68,6.35 84.77,6.35 84.77,9.84 83.82,10.79 80.01,10.79 78.74,12.06 73.66,12.06 72.39,10.79 72.39,8.89
PTB18
  Top 0.152: IC3.7 IC3.8 22.42,63.5 23.94,65.02 26.42,65.02 D0-7.1
PTB19
  Top 0.152: IC3.5 IC3.6 22.61,60.96 23.88,62.23 26.35,62.23 27.62,60.96 D0-7.2
PTC0
  Top 0.152: IC2.5 IC2.6 23.11,48.26 24.38,49.53 26.67,49.53 D0-7.6
PTC1
  Top 0.152: D0-7.3 26.67,57.15 23.62,57.15 22.35,58.42 IC3.4 IC3.3
PTC5
  Top 0.152: IC2.1 IC2.2 25.4,43.18 D0-7.8
PTC7
  Top 0.152: IC2.3 IC2.4 22.61,45.72 23.88,46.99 26.67,46.99 D0-7.7
PTC8
  Top 0.152: IC3.1 IC3.2 22.35,55.88 23.62,54.61 26.67,54.61 D0-7.4
PTC9
  Top 0.152: IC2.7 IC2.8 23.11,50.8 24.38,52.07 26.67,52.07 D0-7.5
PWR_LED
  Top 0.152: R5.2 24.72,9.67 PWR_LED.C
SCL  (via drill 0.38)
  Top 0.152: TEMP(0X48).2 22.54,68.58 23.18,67.94 29.53,67.94 33.34,64.14 39.69,64.14 43.37,60.45 47.5,60.45 I2C-1.4 50.8,57.15 v50.8,48.96 | 7SEG(0X70).24 70.45,84.61 v70.36,84.52
  Bottom 0.152: U$5.SCL 26.1,18.1 41.27,18.1 45.34,22.16 45.34,43.5 v50.8,48.96 | v70.36,84.52 69.85,84.01 69.85,72.07 68.58,70.8 60.33,70.8 54.36,64.83 54.36,60.71 I2C-2.4 I2C-1.4
SDA  (via drill 0.38)
  Top 0.152: TEMP(0X48).1 21.91,70.32 21.91,68.26 22.86,67.31 29.21,67.31 33.02,63.5 39.37,63.5 42.93,59.94 45.47,59.94 I2C-1.3 47.62,53.98 v47.62,48.96 | 7SEG(0X70).23 74.3,83.19 74.04,82.93 72.33,82.93 72.01,83.25 v71.44,83.25
  Bottom 0.152: I2C-1.3 I2C-2.3 55.88,59.69 55.88,64.45 60.96,69.53 69.22,69.53 71.12,71.44 71.12,82.93 v71.44,83.25 | U$5.SDA 28,18.73 40.96,18.73 44.13,21.91 44.13,45.47 v47.62,48.96

### Text on the board
Bottom: R²prototyping gmbh
tPlace: +
tNames: G | BUZZER(D7) | ISP | G | D2 | D3 | D4 | D5 | G | G | D6 | S | V | G | D7 | S | V | G | G | G | (D13) | (D12) | (D11) | (D10) | (D9) | Max 12VDC
bNames: IoTKit V1.0, 2015 | https://github.com/mc-b/IoTKit
tValues: L298P013TR
bStop: R²prototyping gmbh